# EAGLE design boardMecanumArmFinal (EAGLE 7.7.0)
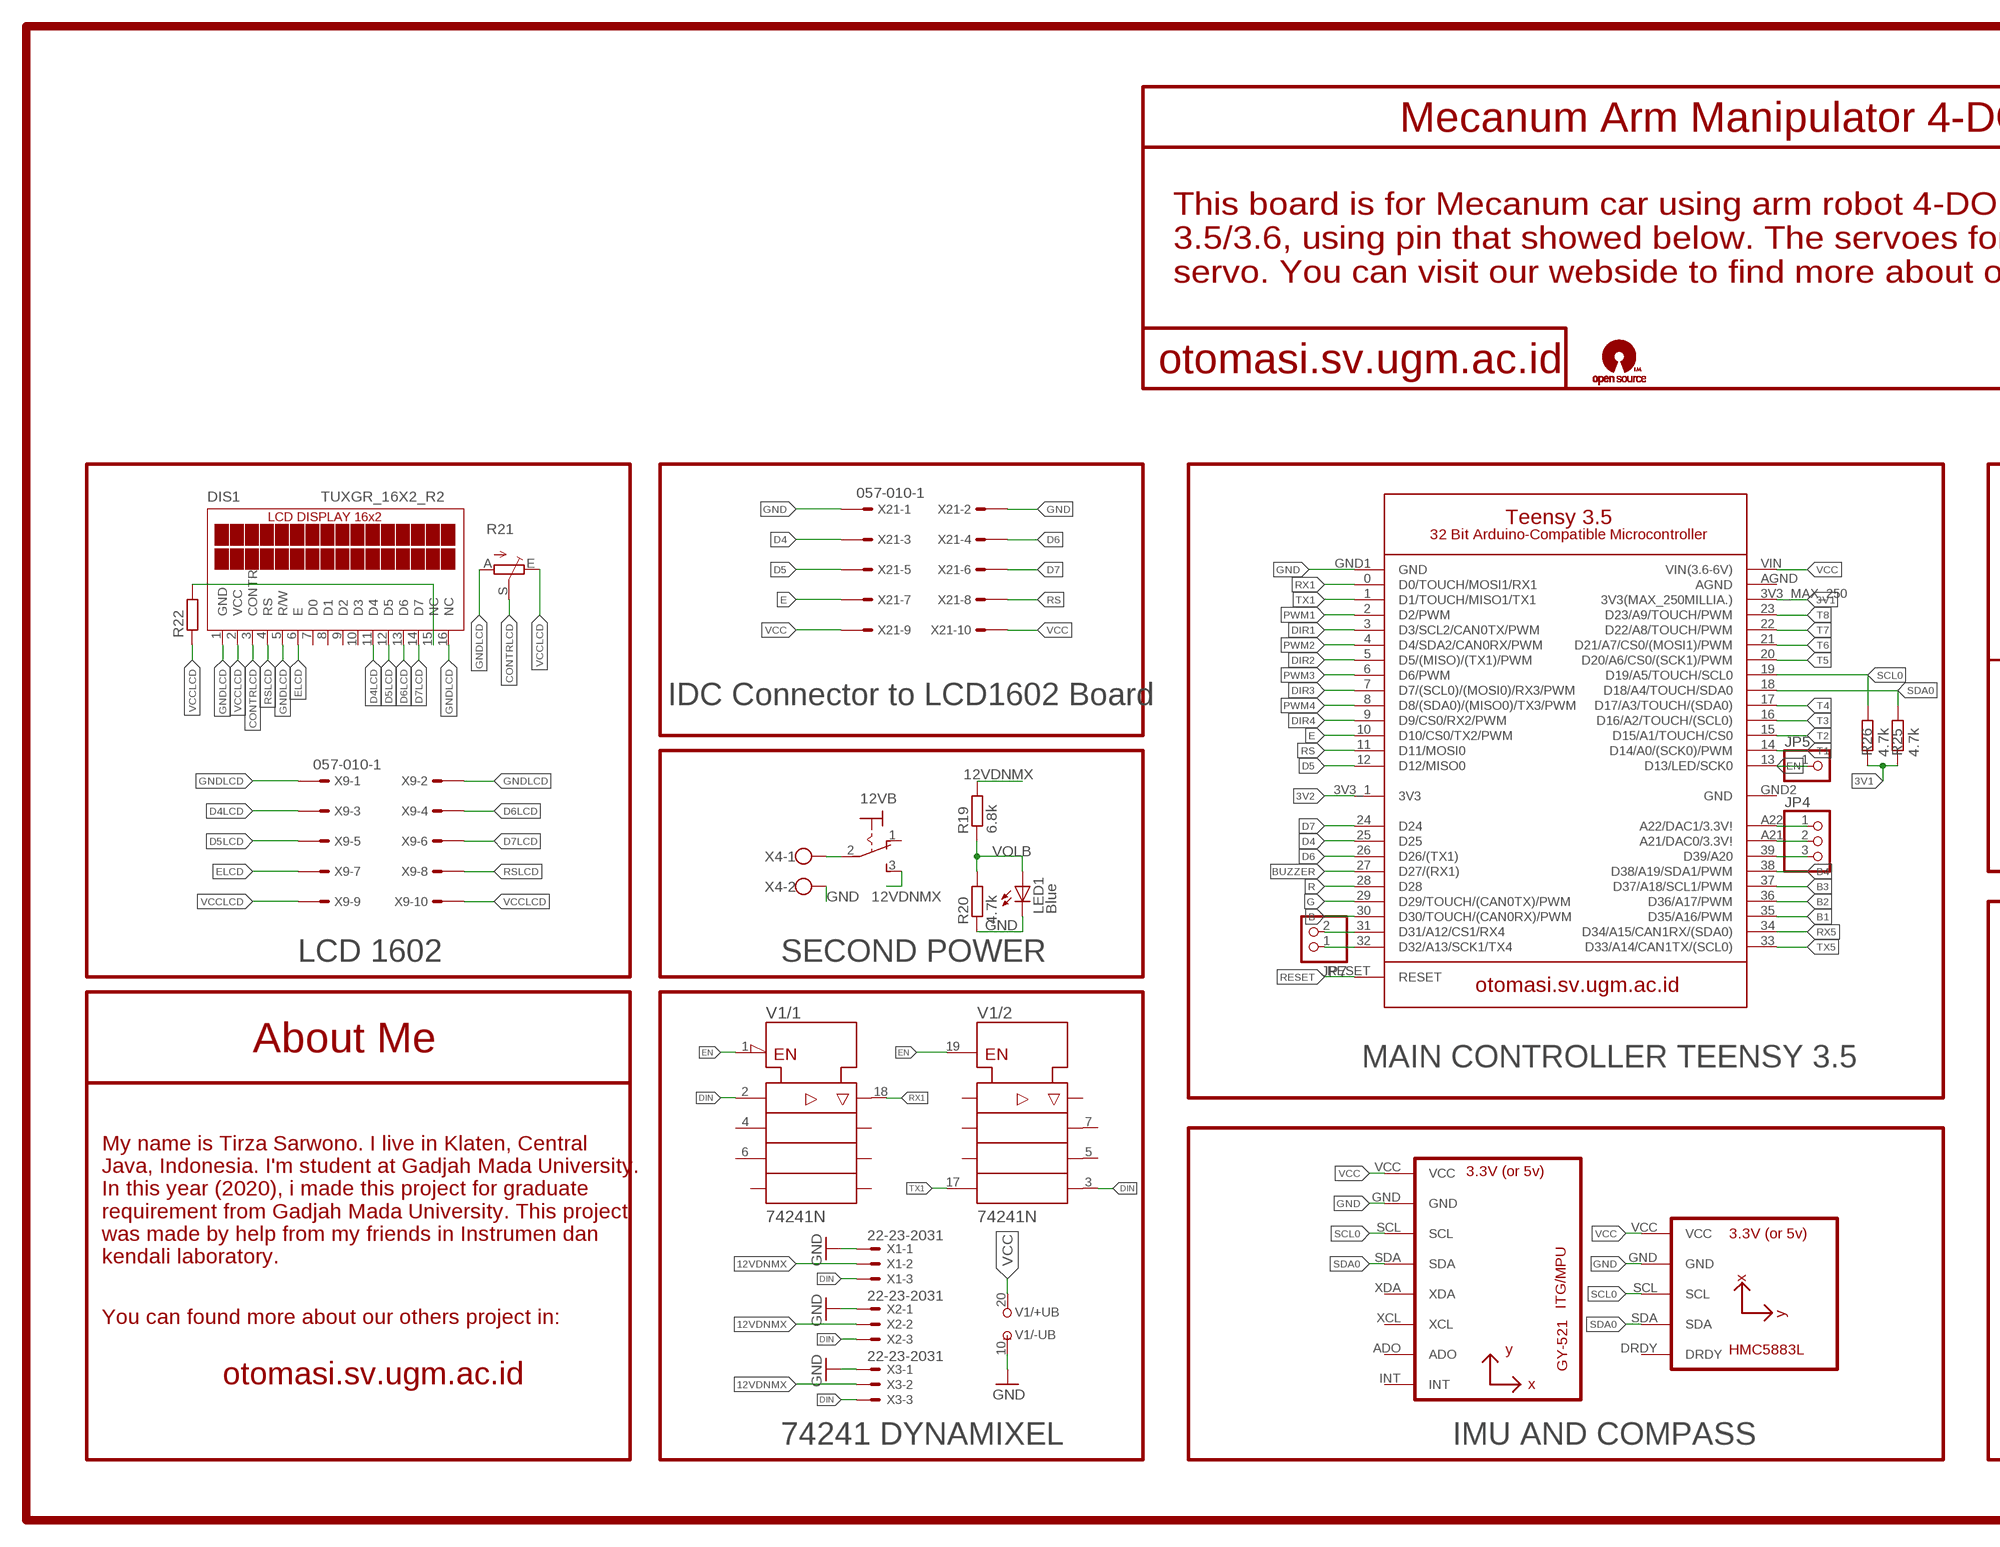
[diagram p0: schematic, sheet 1, part 1 of 2]
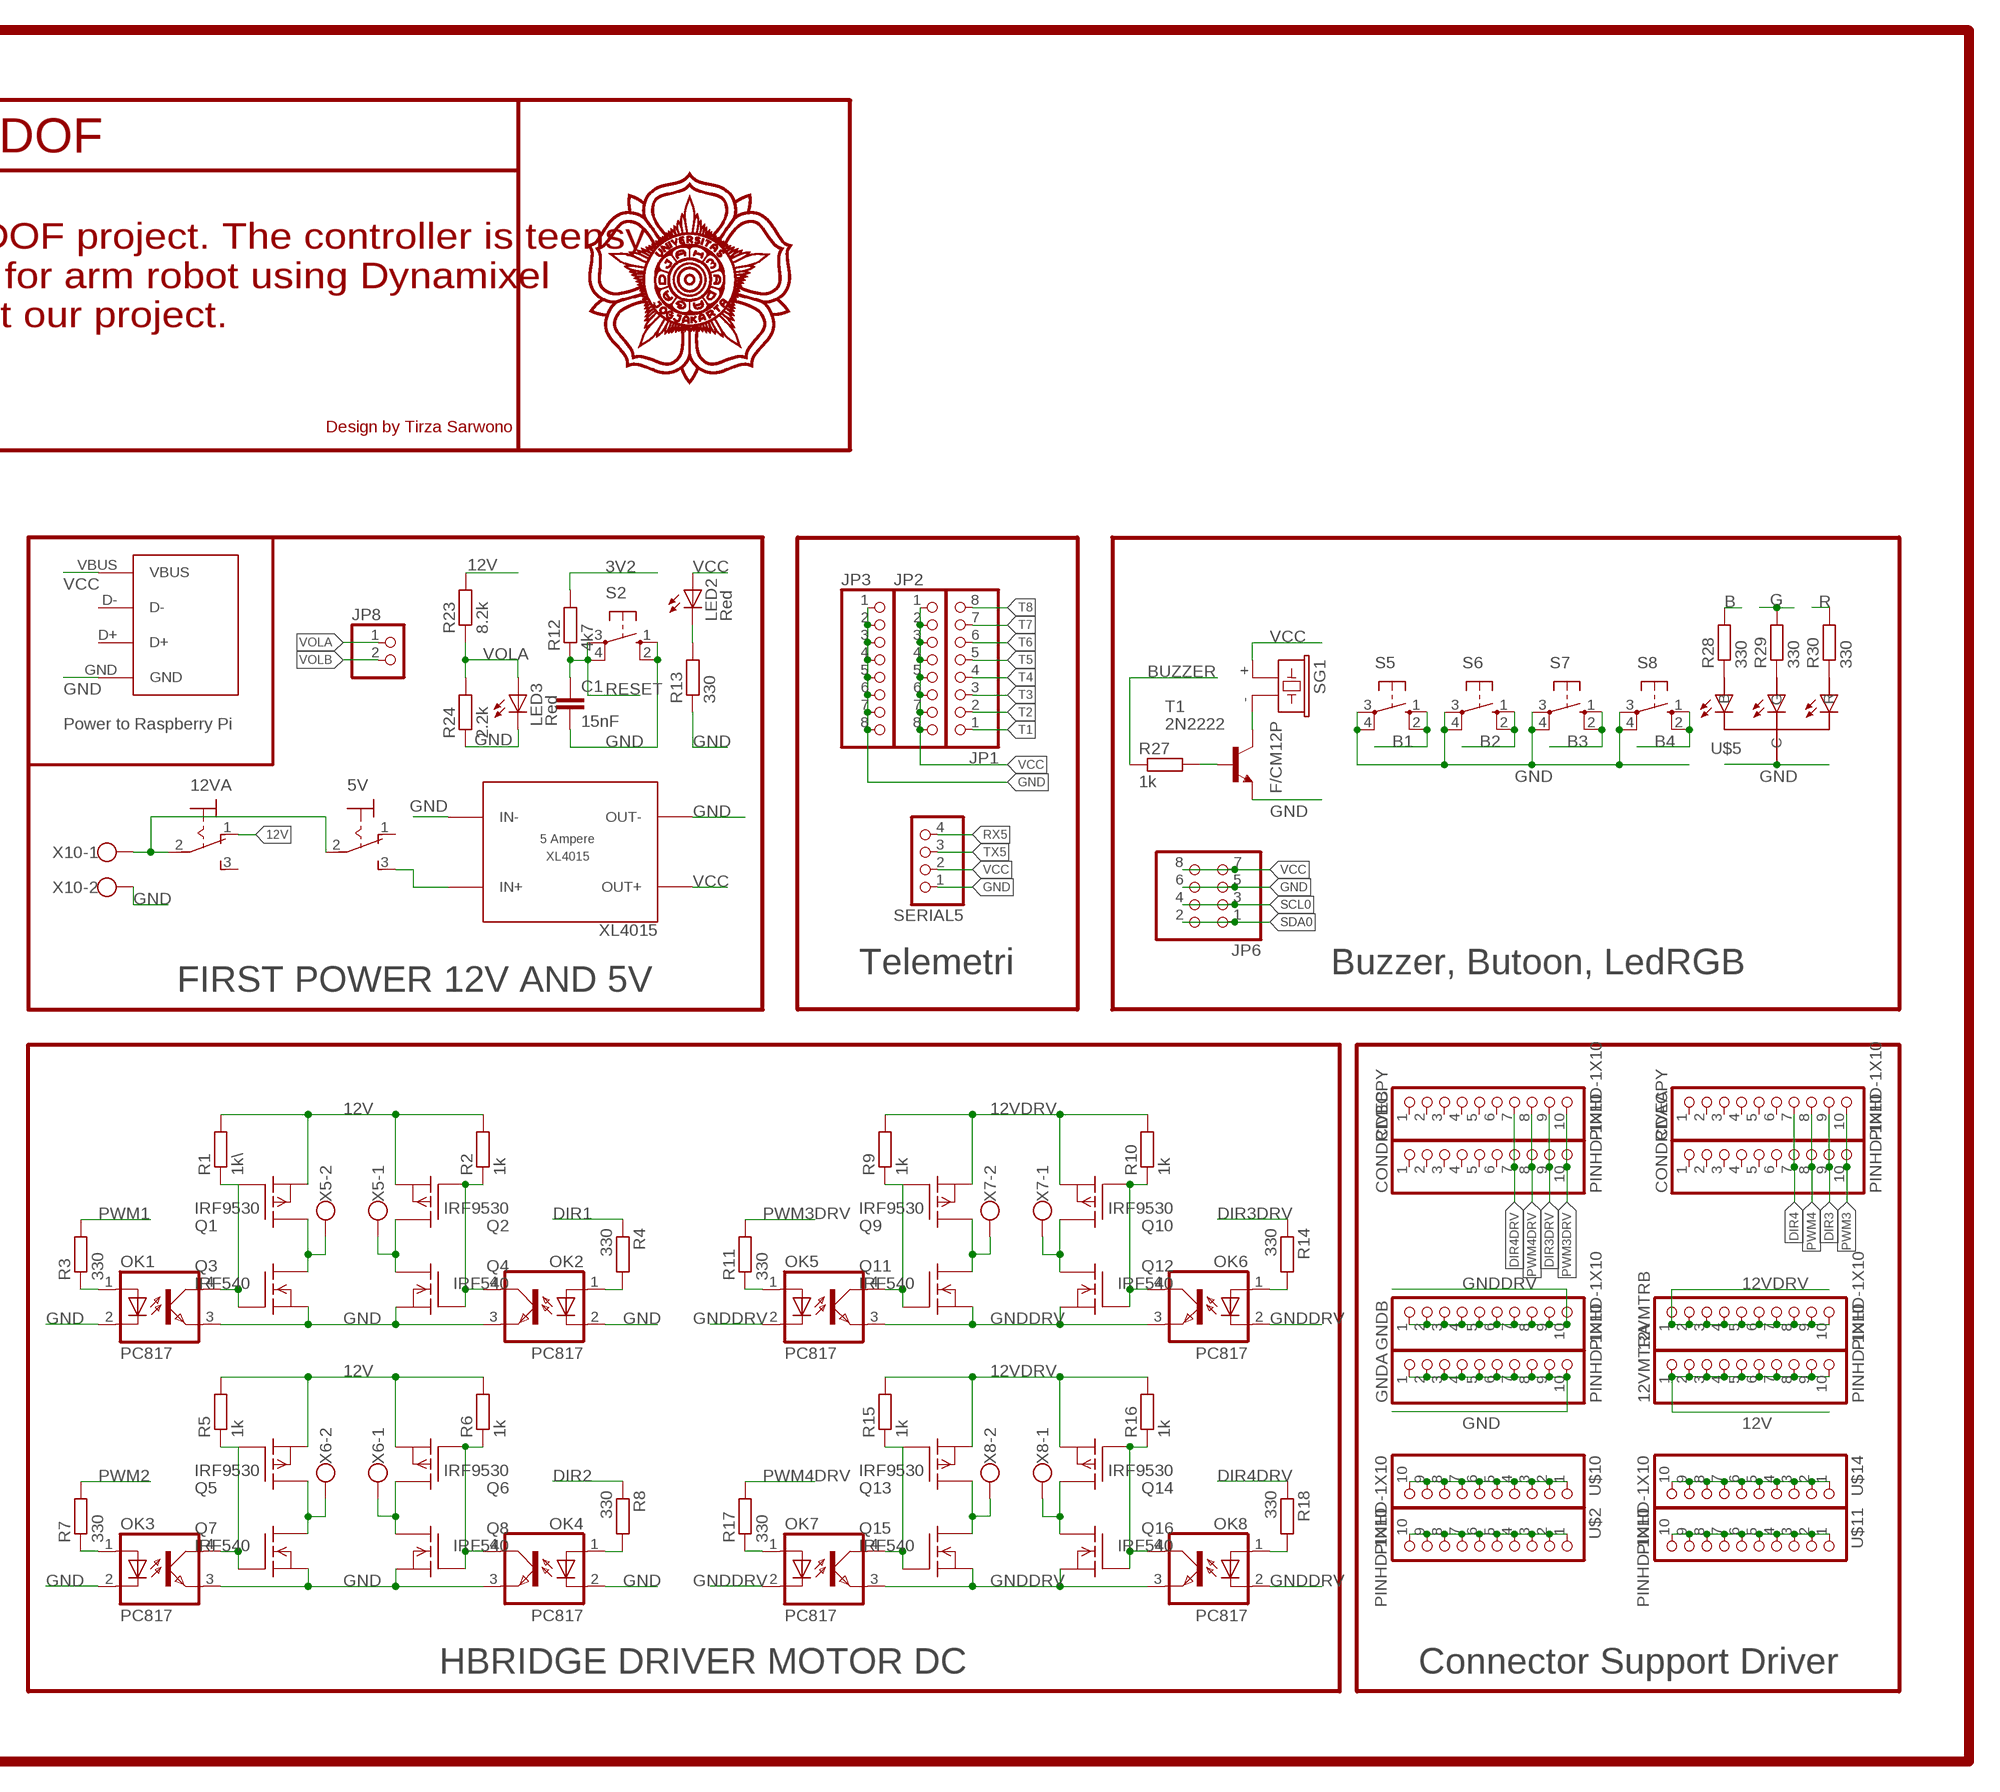
[diagram p1: schematic, sheet 1, part 2 of 2]

## Parts
5V  M9040P  [M9040P]
12VA  M9040P  [M9040P]
12VB  M9040P  [M9040P]
12VMTRA  PINHD-1X10  [1X10-BIG]
12VMTRB  PINHD-1X10  [1X10-BIG]
C1  15nF  C-EUC0805  [C0805]
CDACPY  PINHD-1X10  [1X10-BIG]
CDBCPY  PINHD-1X10  [1X10-BIG]
CONDRIVEA  PINHD-1X10  [1X10-BIG]
CONDRIVEB  PINHD-1X10  [1X10-BIG]
DIS1  TUXGR_16X2_R2  [TUXGR_16X2_R2]
GNDA  PINHD-1X10  [1X10-BIG]
GNDB  PINHD-1X10  [1X10-BIG]
JP1  PINHD-1X8BIG  [1X08-BIG]
JP2  PINHD-1X8BIG  [1X08-BIG]
JP3  PINHD-1X8BIG  [1X08-BIG]
JP4  PINHD-1X3  [1X03]
JP5  PINHD-1X1  [1X01]
JP6  PINHD-2X4  [2X04]
JP7  PINHD-1X2  [1X02]
JP8  PINHD-1X2  [1X02]
LED1  Blue  LED3MM  [LED3MM]
LED2  Red  LED3MM  [LED3MM]
LED3  Red  LED3MM  [LED3MM]
OK1  PC817  [DIL04]
OK2  PC817  [DIL04]
OK3  PC817  [DIL04]
OK4  PC817  [DIL04]
OK5  PC817  [DIL04]
OK6  PC817  [DIL04]
OK7  PC817  [DIL04]
OK8  PC817  [DIL04]
Q1  IRF9530  [TO220]
Q2  IRF9530  [TO220]
Q3  IRF540  [TO220]
Q4  IRF540  [TO220]
Q5  IRF9530  [TO220]
Q6  IRF9530  [TO220]
Q7  IRF540  [TO220]
Q8  IRF540  [TO220]
Q9  IRF9530  [TO220]
Q10  IRF9530  [TO220]
Q11  IRF540  [TO220]
Q12  IRF540  [TO220]
Q13  IRF9530  [TO220]
Q14  IRF9530  [TO220]
Q15  IRF540  [TO220]
Q16  IRF540  [TO220]
R1  1k\  R-EU_0207/7  [0207/7]
R2  1k  R-EU_0207/7  [0207/7]
R3  330  R-EU_0207/7  [0207/7]
R4  330  R-EU_0207/7  [0207/7]
R5  1k  R-EU_0207/7  [0207/7]
R6  1k  R-EU_0207/7  [0207/7]
R7  330  R-EU_0207/7  [0207/7]
R8  330  R-EU_0207/7  [0207/7]
R9  1k  R-EU_0207/7  [0207/7]
R10  1k  R-EU_0207/7  [0207/7]
R11  330  R-EU_0207/7  [0207/7]
R12  4k7  R-EU_R1206  [R1206]
R13  330  R-EU_0207/7  [0207/7]
R14  330  R-EU_0207/7  [0207/7]
R15  1k  R-EU_0207/7  [0207/7]
R16  1k  R-EU_0207/7  [0207/7]
R17  330  R-EU_0207/7  [0207/7]
R18  330  R-EU_0207/7  [0207/7]
R19  6.8k  R-EU_0207/10  [0207/10]
R20  4.7k  R-EU_0207/10  [0207/10]
R21  TRIM_EU-B25P  [B25P]
R22  R-EU_0207/7  [0207/7]
R23  8.2k  R-EU_0207/10  [0207/10]
R24  2.2k  R-EU_0207/10  [0207/10]
R25  4.7k  R-EU_R1206  [R1206]
R26  4.7k  R-EU_R1206  [R1206]
R27  1k  R-EU_R1206  [R1206]
R28  330  R-EU_R1206  [R1206]
R29  330  R-EU_R1206  [R1206]
R30  330  R-EU_R1206  [R1206]
S2  10-XX  [B3F-10XX]
S5  10-XX  [B3F-10XX]
S6  10-XX  [B3F-10XX]
S7  10-XX  [B3F-10XX]
S8  10-XX  [B3F-10XX]
SERIAL5  PINHD-1X4  [1X04]
SG1  F/CM12P  [F/CM12P]
T1  2N2222  [TO92-EBC-OVAL]
U1  HMC5883LMPU6050  [HMC5883L]
U$1  GY-521MPU6050  [GY-521]
U$2  PINHD-1X10  [1X10-BIG]
U$3  TEENSY_35TEENSY_3.5  [TEENSY_35]
U$4  FEMALEUSBTODIP  [FEMALEUSBTODIP]
U$5  RGB_CC  [RGB_CC]
U$10  PINHD-1X10  [1X10-BIG]
U$11  PINHD-1X10  [1X10-BIG]
U$14  PINHD-1X10  [1X10-BIG]
V1  74241N  [DIL20]
X1  22-23-2031  [22-23-2031]
X2  22-23-2031  [22-23-2031]
X3  22-23-2031  [22-23-2031]
X4  W237-102  [W237-102]
X5  W237-102  [W237-102]
X6  W237-102  [W237-102]
X7  W237-102  [W237-102]
X8  W237-102  [W237-102]
X9  057-010-1  [057-010-1]
X10  W237-102  [W237-102]
X21  057-010-1  [057-010-1]
XL4015  XL4015  [XL4015]

## Nets
3V1: R25.2 R26.2 U$3.3V3_MAX_250(3V3(MAX_250MILLIA.))
3V2: R12.2 U$3.3V3_1(3V3)
12V: 12VA.1(O) 12VMTRA.1 12VMTRA.2 12VMTRA.3 12VMTRA.4 12VMTRA.5 12VMTRA.6 12VMTRA.7 12VMTRA.8 12VMTRA.9 12VMTRA.10 Q1.3(S) Q2.3(S) Q5.3(S) Q6.3(S) R1.2 R2.2 R5.2 R6.2 R23.2
12VDNMX: 12VB.3(S) R19.2 X1.2 X2.2 X3.2
12VDRV: 12VMTRB.1 12VMTRB.2 12VMTRB.3 12VMTRB.4 12VMTRB.5 12VMTRB.6 12VMTRB.7 12VMTRB.8 12VMTRB.9 12VMTRB.10 Q9.3(S) Q10.3(S) Q13.3(S) Q14.3(S) R9.2 R10.2 R15.2 R16.2
B: R28.2 U$3.30(D30/TOUCH/(CAN0RX)/PWM)
B1: S5.1(S) S5.2(S1) U$3.35(D35/A16/PWM)
B2: S6.1(S) S6.2(S1) U$3.36(D36/A17/PWM)
B3: S7.1(S) S7.2(S1) U$3.37(D37/A18/SCL1/PWM)
B4: S8.1(S) S8.2(S1) U$3.38(D38/A19/SDA1/PWM)
BUZZER: R27.1 U$3.27(D27/(RX1))
CONTRLCD: DIS1.3(CONTR) R21.S
D4: U$3.25(D25) X21.3
D4LCD: DIS1.11(D4) X9.3
D5: U$3.12(D12/MISO0) X21.5
D5LCD: DIS1.12(D5) X9.5
D6: U$3.26(D26/(TX1)) X21.4
D6LCD: DIS1.13(D6) X9.4
D7: U$3.24(D24) X21.6
D7LCD: DIS1.14(D7) X9.6
DIN: V1.2(/1:A1) V1.3(/2:Y4) X1.3 X2.3 X3.3
DIR1: R4.1 U$3.3(D3/SCL2/CAN0TX/PWM)
DIR2: R8.1 U$3.5(D5/(MISO)/(TX1)/PWM)
DIR3: CDACPY.9 CONDRIVEA.9 U$3.7(D7/(SCL0)/(MOSI0)/RX3/PWM)
DIR3DRV: CDBCPY.9 CONDRIVEB.9 R14.1
DIR4: CDACPY.7 CONDRIVEA.7 U$3.9(D9/CS0/RX2/PWM)
DIR4DRV: CDBCPY.7 CONDRIVEB.7 R18.1
E: U$3.10(D10/CS0/TX2/PWM) X21.7
ELCD: DIS1.6(E) X9.7
EN: JP5.1 U$3.13(D13/LED/SCK0) V1.1(/1:!G) V1.19(/2:G)
G: R29.2 U$3.29(D29/TOUCH/(CAN0TX)/PWM)
GND: C1.2 GNDA.1 GNDA.2 GNDA.3 GNDA.4 GNDA.5 GNDA.6 GNDA.7 GNDA.8 GNDA.9 GNDA.10 JP3.1 JP3.2 JP3.3 JP3.4 JP3.5 JP3.6 JP3.7 JP3.8 JP6.5 JP6.6 LED1.K(C) LED3.K(C) OK1.2(C) OK1.3(EMIT) OK2.2(C) OK2.3(EMIT) OK3.2(C) OK3.3(EMIT) OK4.2(C) OK4.3(EMIT) Q3.3(S) Q4.3(S) Q7.3(S) Q8.3(S) R13.1 R20.1 R24.1 S2.1(S) S2.2(S1) S5.3(P) S5.4(P1) S6.3(P) S6.4(P1) S7.3(P) S7.4(P1) S8.3(P) S8.4(P1) SERIAL5.1 T1.E U1.GND U$1.GND U$3.GND1(GND) U$4.GND U$5.C V1.10(/-UB:-UB) X1.1 X2.1 X3.1 X4.2 X10.2 X21.1 X21.2 XL4015.IN- XL4015.OUT-
GNDDRV: GNDB.1 GNDB.2 GNDB.3 GNDB.4 GNDB.5 GNDB.6 GNDB.7 GNDB.8 GNDB.9 GNDB.10 OK5.2(C) OK5.3(EMIT) OK6.2(C) OK6.3(EMIT) OK7.2(C) OK7.3(EMIT) OK8.2(C) OK8.3(EMIT) Q11.3(S) Q12.3(S) Q15.3(S) Q16.3(S)
GNDLCD: DIS1.1(GND) DIS1.5(R/W) DIS1.16(NC) R21.A X9.1 X9.2
N$1: Q1.2(D) Q3.2(D) X5.2
N$2: Q2.2(D) Q4.2(D) X5.1
N$3: OK1.4(COL) Q1.1(G) Q3.1(G) R1.1
N$4: Q5.2(D) Q7.2(D) X6.2
N$5: R27.2 T1.B
N$7: OK2.4(COL) Q2.1(G) Q4.1(G) R2.1
N$8: Q6.2(D) Q8.2(D) X6.1
N$9: OK3.4(COL) Q5.1(G) Q7.1(G) R5.1
N$10: OK4.4(COL) Q6.1(G) Q8.1(G) R6.1
N$11: OK1.1(A) R3.1
N$12: OK3.1(A) R7.1
N$13: OK2.1(A) R4.2
N$14: OK4.1(A) R8.2
N$15: Q9.2(D) Q11.2(D) X7.2
N$16: Q10.2(D) Q12.2(D) X7.1
N$17: OK5.4(COL) Q9.1(G) Q11.1(G) R9.1
N$18: OK6.4(COL) Q10.1(G) Q12.1(G) R10.1
N$19: OK5.1(A) R11.1
N$20: OK6.1(A) R14.2
N$21: Q13.2(D) Q15.2(D) X8.2
N$22: Q14.2(D) Q16.2(D) X8.1
N$23: OK7.4(COL) Q13.1(G) Q15.1(G) R15.1
N$24: OK8.4(COL) Q14.1(G) Q16.1(G) R16.1
N$25: OK7.1(A) R17.1
N$26: OK8.1(A) R18.2
N$31: 12VB.2(P) X4.1
N$32: JP4.3 U$3.39(D39/A20)
N$33: 5V.2(P) 12VA.2(P) X10.1
N$34: 5V.3(S) XL4015.IN+
N$35: LED2.K(C) R13.2
N$36: U$10.1 U$10.2 U$10.3 U$10.4 U$10.5 U$10.6 U$10.7 U$10.8 U$10.9 U$10.10
N$37: R28.1 U$5.B
N$38: SG1.- T1.C
N$39: R29.1 U$5.G
N$40: R30.1 U$5.R
N$41: JP4.2 U$3.A21(A21/DAC0/3.3V!)
N$42: DIS1.15(NC) R22.2
N$43: JP4.1 U$3.A22(A22/DAC1/3.3V!)
N$44: U$2.1 U$2.2 U$2.3 U$2.4 U$2.5 U$2.6 U$2.7 U$2.8 U$2.9 U$2.10
N$45: U$14.1 U$14.2 U$14.3 U$14.4 U$14.5 U$14.6 U$14.7 U$14.8 U$14.9 U$14.10
N$46: JP7.1 U$3.32(D32/A13/SCK1/TX4)
N$47: JP7.2 U$3.31(D31/A12/CS1/RX4)
N$49: U$11.1 U$11.2 U$11.3 U$11.4 U$11.5 U$11.6 U$11.7 U$11.8 U$11.9 U$11.10
PWM1: R3.2 U$3.2(D2/PWM)
PWM2: R7.2 U$3.4(D4/SDA2/CAN0RX/PWM)
PWM3: CDACPY.10 CONDRIVEA.10 U$3.6(D6/PWM)
PWM3DRV: CDBCPY.10 CONDRIVEB.10 R11.2
PWM4: CDACPY.8 CONDRIVEA.8 U$3.8(D8/(SDA0)/(MISO0)/TX3/PWM)
PWM4DRV: CDBCPY.8 CONDRIVEB.8 R17.2
R: R30.2 U$3.28(D28)
RESET: C1.1 R12.1 S2.3(P) S2.4(P1) U$3.RESET
RS: U$3.11(D11/MOSI0) X21.8
RSLCD: DIS1.4(RS) X9.8
RX1: U$3.0(D0/TOUCH/MOSI1/RX1) V1.18(/1:Y1)
RX5: SERIAL5.4 U$3.34(D34/A15/CAN1RX/(SDA0))
SCL0: JP6.3 JP6.4 R26.1 U1.SCL U$1.SCL U$3.19(D19/A5/TOUCH/SCL0)
SDA0: JP6.1 JP6.2 R25.1 U1.SDA U$1.SDA U$3.18(D18/A4/TOUCH/SDA0)
T1: JP1.1 U$3.14(D14/A0/(SCK0)/PWM)
T2: JP1.2 U$3.15(D15/A1/TOUCH/CS0)
T3: JP1.3 U$3.16(D16/A2/TOUCH/(SCL0))
T4: JP1.4 U$3.17(D17/A3/TOUCH/(SDA0))
T5: JP1.5 U$3.20(D20/A6/CS0/(SCK1)/PWM)
T6: JP1.6 U$3.21(D21/A7/CS0/(MOSI1)/PWM)
T7: JP1.7 U$3.22(D22/A8/TOUCH/PWM)
T8: JP1.8 U$3.23(D23/A9/TOUCH/PWM)
TX1: U$3.1(D1/TOUCH/MISO1/TX1) V1.17(/2:A4)
TX5: SERIAL5.3 U$3.33(D33/A14/CAN1TX/(SCL0))
VCC: JP2.1 JP2.2 JP2.3 JP2.4 JP2.5 JP2.6 JP2.7 JP2.8 JP6.7 JP6.8 LED2.A SERIAL5.2 SG1.+ U1.VCC U$1.VCC U$3.VIN(VIN(3.6-6V)) U$4.VBUS V1.20(/+UB:+UB) X21.9 X21.10 XL4015.OUT+
VCCLCD: DIS1.2(VCC) R21.E R22.1 X9.9 X9.10
VOLA: JP8.1 LED3.A R23.1 R24.2
VOLB: JP8.2 LED1.A R19.1 R20.2
Unconnected: 5V.1(O) 12VA.3(S) 12VB.1(O) CDACPY.1 CDACPY.2 CDACPY.3 CDACPY.4 CDACPY.5 CDACPY.6 CDBCPY.1 CDBCPY.2 CDBCPY.3 CDBCPY.4 CDBCPY.5 CDBCPY.6 CONDRIVEA.1 CONDRIVEA.2 CONDRIVEA.3 CONDRIVEA.4 CONDRIVEA.5 CONDRIVEA.6 CONDRIVEB.1 CONDRIVEB.2 CONDRIVEB.3 CONDRIVEB.4 CONDRIVEB.5 CONDRIVEB.6 DIS1.7(D0) DIS1.8(D1) DIS1.9(D2) DIS1.10(D3) U1.DRDY U$1.ADO U$1.INT U$1.XCL U$1.XDA U$4.D+ U$4.D- V1.4(/1:A2) V1.5(/2:Y3) V1.6(/1:A3) V1.7(/2:Y2)

## Notes on the sheet
- Mecanum Arm Manipulator 4-DOF
- This board is for Mecanum car using arm robot 4-DOF project. The controller is teensy 
  3.5/3.6, using pin that showed below. The servoes for arm robot using Dynamixel 
  servo. You can visit our webside to find more about our project.
- otomasi.sv.ugm.ac.id | Design by Tirza Sarwono
- Power to Raspberry Pi
- IDC Connector to LCD1602 Board
- Telemetri | Buzzer, Butoon, LedRGB
- FIRST POWER 12V AND 5V
- LCD 1602 | SECOND POWER
- About Me
- MAIN CONTROLLER TEENSY 3.5
- My name is Tirza Sarwono. I live in Klaten, Central
  Java, Indonesia. I'm student at Gadjah Mada University. 
  In this year (2020), i made this project for graduate 
  requirement from Gadjah Mada University. This project 
  was made by help from my friends in Instrumen dan 
  kendali laboratory.
- You can found more about our others project in:
- otomasi.sv.ugm.ac.id
- 74241 DYNAMIXEL | IMU AND COMPASS | HBRIDGE DRIVER MOTOR DC | Connector Support Driver

## Power pins joined to a net without a drawn wire
AGND: U$3.AGND
GND: U$3.GND2(GND)

## Library data of the parts
5V 12VA 12VB = switch:M9040P: TOGGLE SWITCH Marquardt
12VMTRA 12VMTRB CDACPY CDBCPY CONDRIVEA CONDRIVEB GNDA GNDB U$2 U$10 U$11 U$14 = adafruit:PINHD-1X10: Pin header 1x10 0.1" spacing With round pins
C1 = rcl:C-EU: CAPACITOR, European symbol
DIS1 = display-lcd:TUXGR_16X2_R2: Tuxgraphics LCD display 16x2 characters reflective, without background light Source: tuxgr_12x2_r2.pdf; OC_FARNELL: unknown; OC_NEWARK: unknown
JP1-JP3 = adafruit:PINHD-1X8: PIN HEADER
JP4 = adafruit:PINHD-1X3: PIN HEADER
JP5 = adafruit:PINHD-1X1: Pin header 1x1 for 0.1" spacing With round pins
JP6 = pinhead:PINHD-2X4: PIN HEADER
JP7 JP8 = pinhead:PINHD-1X2: PIN HEADER
LED1-LED3 = led:LED: LED OSRAM: - CHIPLED LG R971, LG N971, LY N971, LG Q971, LY Q971, LO R971, LY R971 LH N974, LH R974 LS Q976, LO Q976, LY Q976 LO Q996 - Hyper CHIPLED LW Q18S LB Q993, LB Q99A, LB R99A - SideLED LS A670, LO A670, LY A670, LG A670, LP A670 LB A673, LV A673, LT A673, LW A673 LH A674 LY A675 LS A676, LA A676, LO A676, LY A676, LW A676 LS A679, LY A679, LG A679 - Hyper Micro SIDELED® LS Y876, LA Y876, LO Y876, LY Y876 LT Y87S - SmartLED LW L88C, LW L88S LB L89C, LB L89S, LG L890 LS L89K, LO L89K, LY L89K LS L896, LA L896, LO L896, LY L896 - TOPLED LS T670, LO T670, LY T670, LG T670, LP T670 LSG T670, LSP T670, LSY T670, LOP T670, LYG T670 LG T671, LOG T671, LSG T671 LB T673, LV T673, LT T673, LW T673 LH T674 LS T676, LA T676, LO T676, LY T676, LB T676, LH T676, LSB T676, LW T676 LB T67C, LV T67C, LT T67C, LS T67K, LO T67K, LY T67K, LW E67C LS E67B, LA E67B, LO E67B, LY E67B, LB E67C, LV E67C, LT E67C LW T67C LS T679, LY T679, LG T679 LS T770, LO T770, LY T770, LG T770, LP T770 LB T773, LV T773, LT T773, LW T773 LH T774 LS E675, LA E675, LY E675, LS T675 LS T776, LA T776, LO T776, LY T776, LB T776 LHGB T686 LT T68C, LB T68C - Hyper Mini TOPLED® LB M676 - Mini TOPLED Santana® LG M470 LS M47K, LO M47K, LY M47K Source: http://www.osram.convergy.de LUXEON: - LUMILED® LXK2-PW12-R00, LXK2-PW12-S00, LXK2-PW14-U00, LXK2-PW14-V00 LXK2-PM12-R00, LXK2-PM12-S00, LXK2-PM14-U00 LXK2-PE12-Q00, LXK2-PE12-R00, LXK2-PE12-S00, LXK2-PE14-T00, LXK2-PE14-U00 LXK2-PB12-K00, LXK2-PB12-L00, LXK2-PB12-M00, LXK2-PB14-N00, LXK2-PB14-P00, LXK2-PB14-Q00 LXK2-PR12-L00, LXK2-PR12-M00, LXK2-PR14-Q00, LXK2-PR14-R00 LXK2-PD12-Q00, LXK2-PD12-R00, LXK2-PD12-S00 LXK2-PH12-R00, LXK2-PH12-S00 LXK2-PL12-P00, LXK2-PL12-Q00, LXK2-PL12-R00 Source: www.luxeon.com KINGBRIGHT: KA-3528ASYC Source: www.kingbright.com
OK1-OK8 = PIC817:PC817: SHARP OPTO COUPLER; MPN: PC817X4J000F; OC_FARNELL: 9707727; OC_NEWARK: 97K7059
Q1 Q2 Q5 Q6 Q9 Q10 Q13 Q14 = transistor-fet:IRF9530: P-Channel Enhancement MOSFET (HEXFET); -100V; -12A; 0,3Ohm
Q3 Q4 Q7 Q8 Q11 Q12 Q15 Q16 = transistor-fet:IRF540: N-Channel Enhancement MOSFET (HEXFET); 100V; 28A; 0,077Ohm
R1-R20 R22-R30 = rcl:R-EU_: RESISTOR, European symbol
R21 = pot:TRIM_EU-: POTENTIOMETER
S2 S5-S8 = switch-omron:10-XX: OMRON SWITCH; MPN: B3F-1000; OC_FARNELL: 176432; OC_NEWARK: 36M3542
SERIAL5 = pinhead:PINHD-1X4: PIN HEADER
SG1 = buzzer:F/CM12P: BUZZER Source: Buerklin; OC_FARNELL: unknown; OC_NEWARK: unknown
T1 = adafruit:2N2222: NPN TRANSISTOR Big oval pads
U1 = HMC5883L:HMC5883L
U$1 = MPU6050:GY-521
U$3 = teensy35NoInside:TEENSY_35: otomasi.sv.ugm.ac.id
U$4 = femaleUsbToDIP:FEMALEUSBTODIP: otomasi.sv.ugm.ac.id
U$5 = ledRGB5MM:RGB_CC: otomasi.sv.ugm.ac.id
V1 = 74241custom:74*241: otomasi.sv.ugm.ac.id
X1-X3 = con-molex:22-23-2031: .100" (2.54mm) Center Header - 3 Pin; MF: MOLEX; MPN: 22-23-2031; OC_FARNELL: 1462950; OC_NEWARK: 30C0862
X4-X8 X10 = wago102:W237-102: WAGO SCREW CLAMP; MPN: 237-102; OC_FARNELL: unknown; OC_NEWARK: 70K9898
X9 X21 = con-panduit:057-010-: CONNECTOR 10-pin series 057 contact pc board low profile headers; OC_FARNELL: unknown; OC_NEWARK: unknown
XL4015 = xl4015:XL4015: otomasi.sv.ac.id

## Board
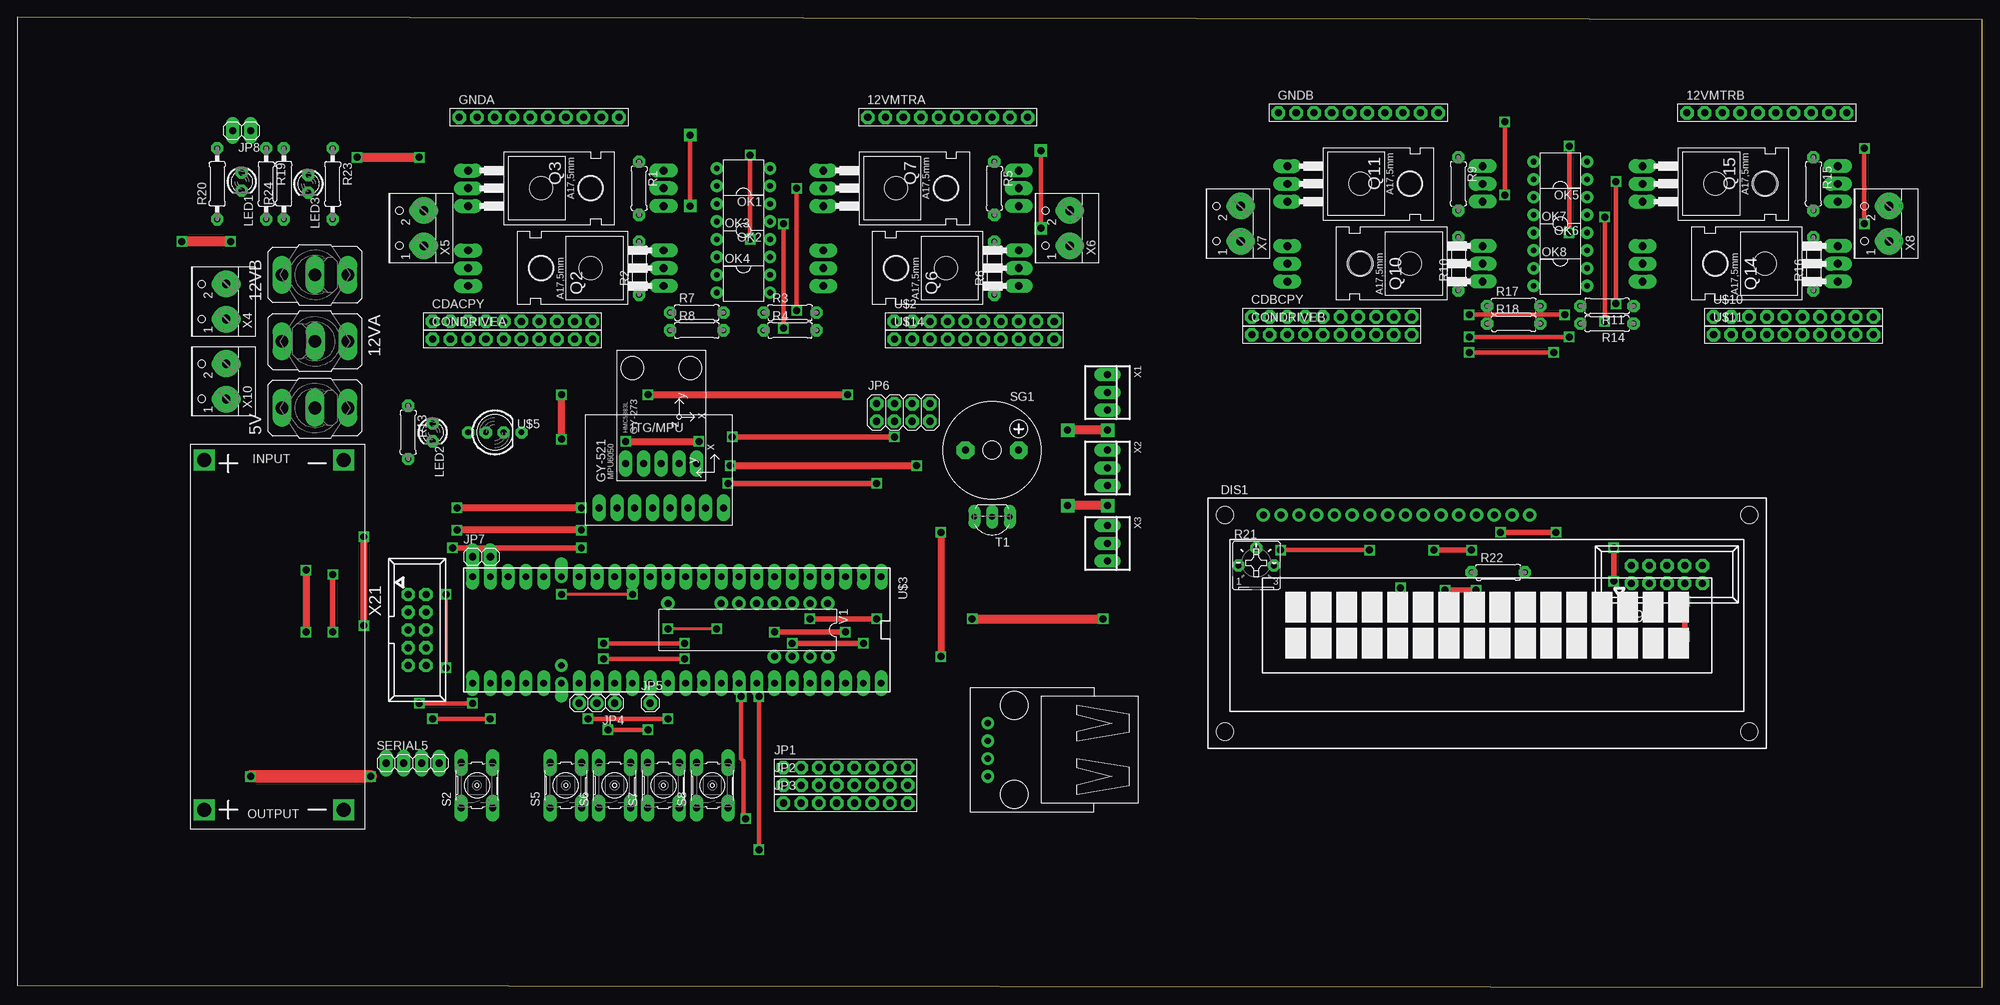
[diagram p2: board, top side]
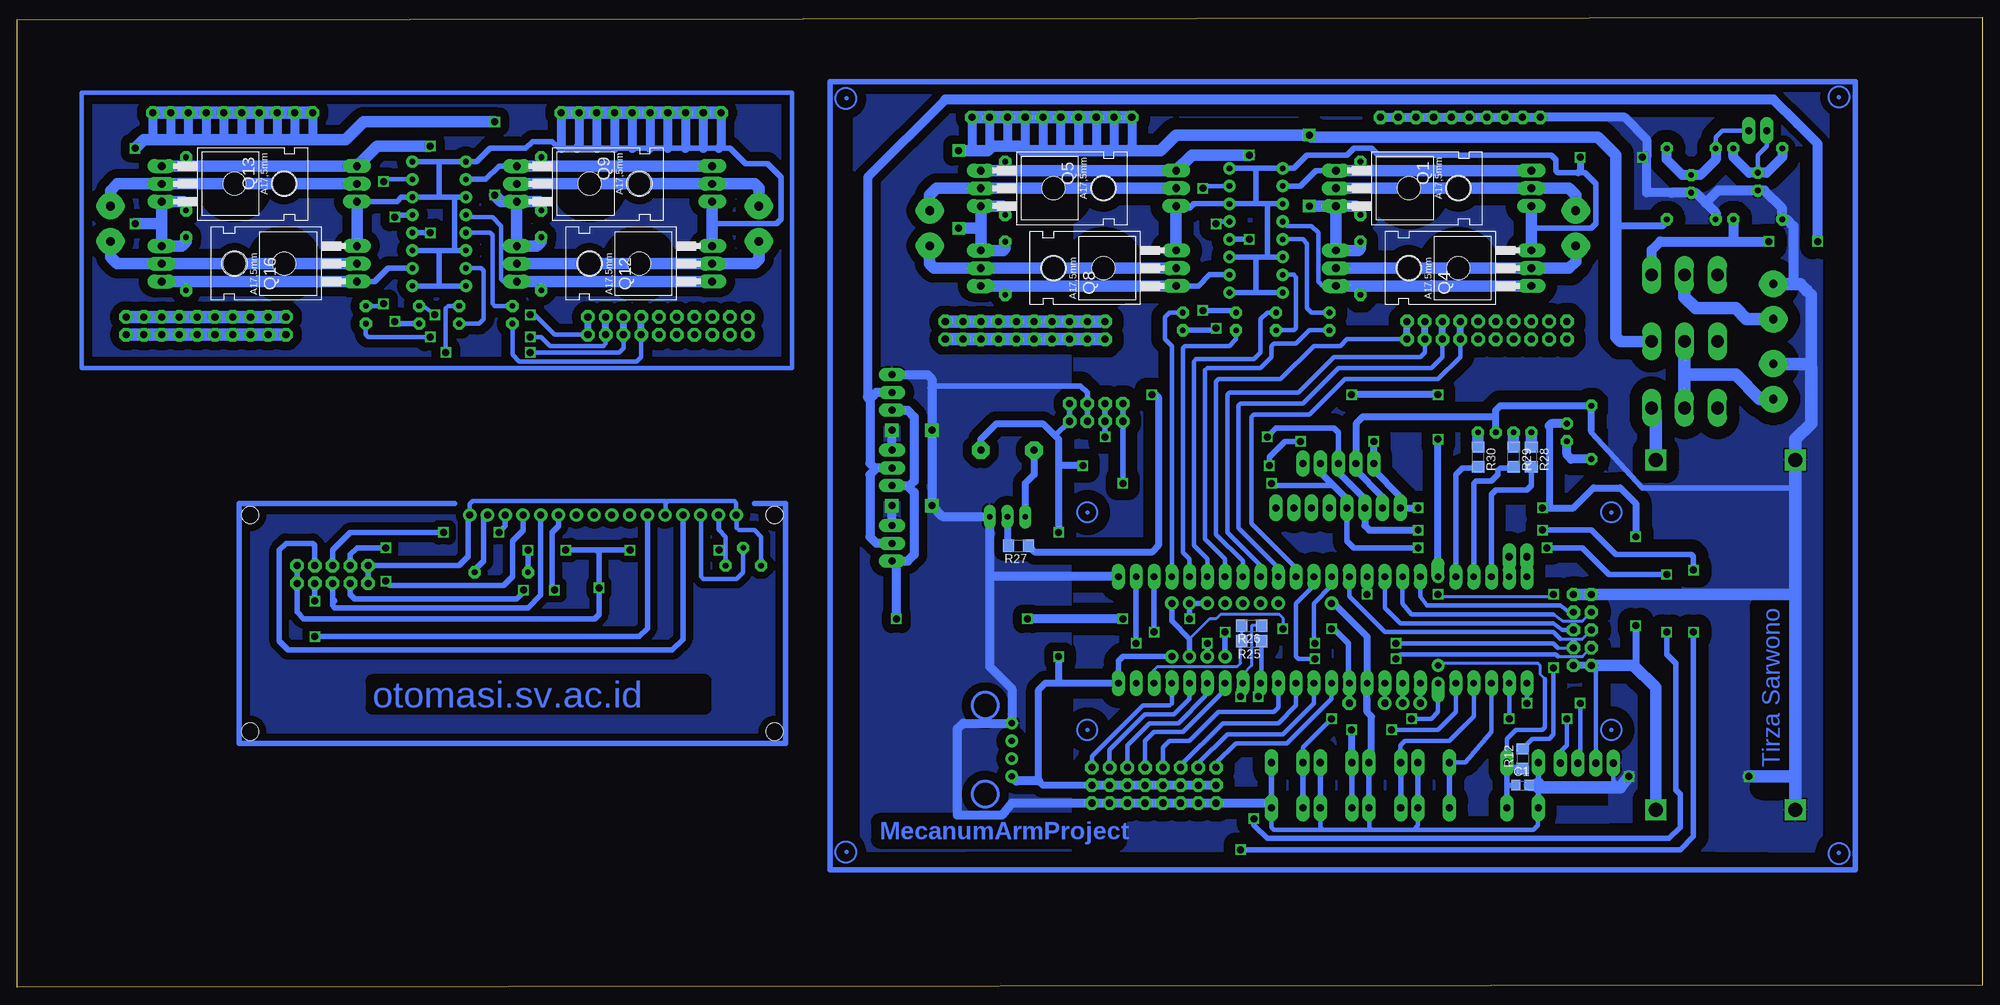
[diagram p3: board, bottom side, seen from below]

Size 280.97 x 138.73 mm. Coordinates in mm from the lower left corner, seen from the top.
Outline: 0,0.32 280.97,0 280.97,138.42 0,138.73 0,0.32
Copper layers (1*16): Top 0.035mm / dielectric 1.5mm / Bottom 0.035mm
Design rules "default *": minimum track width 10mil, minimum drill 24mil, track to track 8mil, track to pad 8mil, pad to pad 8mil, via to via 8mil, smd to smd 8mil, copper to edge 40mil, drill to drill 8mil, minimum pad ring 18mil, minimum via ring 8mil, stop-mask expansion 4mil, vias tented up to drill 0mil, thermal gap 10mil
vRestrict: area 21.9,130.5 to 23.4,131.1; area 159.8,130.5 to 161.3,131.1; area 87.4,131.2 to 95.8,133; area 19.4,127.1 to 20,128.6; area 19.4,18.4 to 20,19.9; area 20.1,69.3 to 21.9,77.7; 12 lines
Milling: area 386.1,87.5 to 391.5,92.9; area 291.3,87.6 to 296.7,93; area 293.7,90 to 294.4,90.7; area 388.4,89.8 to 389.1,90.5; area 296.6,86.1 to 297.1,86.6; area 296.5,83.5 to 297.2,84.1; area 381.6,115.2 to 382.3,115.9; area 300.4,115.3 to 301,115.9; area 385.4,83.5 to 386.1,84.2; area 385.6,45.1 to 391,50.5; area 290.8,45.2 to 296.2,50.6; area 293.2,47.6 to 293.9,48.3; 24 more areas; 16 lines

### Footprints (pad centres in the part's own frame; a part is rotated, then mirrored left to right if it is on the bottom)
M9040P = drill 1.803 long: 1 0,4.699; 2 0,0; 3 0,-4.699
1X10-BIG = drill 1.016 pad 1.778 octagon: 1 -11.43,0; 2 -8.89,0; 3 -6.35,0; 4 -3.81,0; 5 -1.27,0; 6 1.27,0; 7 3.81,0; 8 6.35,0; 9 8.89,0; 10 11.43,0
C0805 = smd 1.3 x 1.5: 1 -0.95,0; 2 0.95,0
TUXGR_16X2_R2 = drill 1 pad 1.676: 1 -32,15.5; 2 -29.46,15.5; 3 -26.92,15.5; 4 -24.38,15.5; 5 -21.84,15.5; 6 -19.3,15.5; 7 -16.76,15.5; 8 -14.22,15.5; 9 -11.68,15.5; 10 -9.14,15.5; 11 -6.6,15.5; 12 -4.06,15.5; 13 -1.52,15.5; 14 1.02,15.5; 15 3.56,15.5; 16 6.1,15.5 | hole 2.5: -37.5,-15.5; 37.5,-15.5; -37.5,15.5; 37.5,15.5
1X08-BIG = drill 1.016 pad 1.778 octagon: 1 -8.89,0; 2 -6.35,0; 3 -3.81,0; 4 -1.27,0; 5 1.27,0; 6 3.81,0; 7 6.35,0; 8 8.89,0
1X03 = drill 1.016: 1 -2.54,0; 2 0,0; 3 2.54,0
1X01 = drill 1.016 pad 1.93 octagon: 1 0,0
2X04 = drill 1.016 octagon: 1 -3.81,-1.27; 2 -3.81,1.27; 3 -1.27,-1.27; 4 -1.27,1.27; 5 1.27,-1.27; 6 1.27,1.27; 7 3.81,-1.27; 8 3.81,1.27
1X02 = drill 1.016 long: 1 -1.27,0; 2 1.27,0
LED3MM = drill 0.813 octagon: A -1.27,0; K 1.27,0
DIL04 = drill 0.813 pad 1.778: 1 -1.27,-3.81; 2 1.27,-3.81; 3 1.27,3.81; 4 -1.27,3.81
TO220 = drill 1.118 long: 1 -2.54,-6.35; 2 0,-6.35; 3 2.54,-6.35 | hole 3.302: 0,11.176
0207/7 = drill 0.813 octagon: 1 -3.81,0; 2 3.81,0
R1206 = smd 1.6 x 1.803: 1 -1.422,0; 2 1.422,0
0207/10 = drill 0.813 octagon: 1 -5.08,0; 2 5.08,0
B25P = drill 0.813 octagon: A -2.54,0; E 2.54,0; S 0,2.54
B3F-10XX = drill 1.016 long: 1 -3.251,2.261; 2 3.251,2.261; 3 -3.251,-2.261; 4 3.251,-2.261
1X04 = drill 1.016 long: 1 -3.81,0; 2 -1.27,0; 3 1.27,0; 4 3.81,0
F/CM12P = drill 1.016 pad 2.54 octagon: + 3.81,0; - -3.81,0
TO92-EBC-OVAL = drill 0.813 long: B 0,-1.27; C 2.54,-1.27; E -2.54,-1.27
HMC5883L = drill 1 pad 1.422 long: DRDY 7.62,5.08; GND 7.62,-2.54; SCL 7.62,0; SDA 7.62,2.54; VCC 7.62,-5.08
GY-521 = drill 1 pad 1.778 long: ADO -8.89,-6.35; GND -8.89,6.35; INT -8.89,-8.89; SCL -8.89,3.81; SDA -8.89,1.27; VCC -8.89,8.89; XCL -8.89,-3.81; XDA -8.89,-1.27
TEENSY_35 = drill 0.965 pad 1.676 long: 0 -7.62,5.08; 1 -7.62,2.54; 2 -7.62,0; 3 -7.62,-2.54; 3V3_1 -7.62,-27.94; 3V3_MAX_250 7.62,2.54; 4 -7.62,-5.08; 5 -7.62,-7.62; 6 -7.62,-10.16; 7 -7.62,-12.7; 8 -7.62,-15.24; 9 -7.62,-17.78; 10 -7.62,-20.32; 11 -7.62,-22.86; 12 -7.62,-25.4; 13 7.62,-25.4; 14 7.62,-22.86; 15 7.62,-20.32; 16 7.62,-17.78; 17 7.62,-15.24; 18 7.62,-12.7; 19 7.62,-10.16; 20 7.62,-7.62; 21 7.62,-5.08; 22 7.62,-2.54; 23 7.62,0; 24 -7.62,-30.48; 25 -7.62,-33.02; 26 -7.62,-35.56; 28 -7.62,-40.64; 29 -7.62,-43.18; 30 -7.62,-45.72; 31 -7.62,-48.26; 32 -7.62,-50.8; 33 7.62,-50.8; 34 7.62,-48.26; 35 7.62,-45.72; 36 7.62,-43.18; 37 7.62,-40.64; 39 7.62,-35.56; A21 7.62,-33.02; A22 7.62,-30.48; AGND 7.62,5.08; GND1 -7.62,7.62; GND2 7.62,-27.94; VIN 7.62,7.62 | drill 0.965 pad 1.778 offset: 27 -7.62,-38.1; 38 7.62,-38.1 | drill 0.9 pad 1.778: RESET 5.08,-38.1
FEMALEUSBTODIP = drill 0.9 pad 1.778: D+ 0,-5.08; D- 2.54,-5.08; GND -2.54,-5.08; VBUS 5.08,-5.08
RGB_CC = drill 0.813 octagon: B -3.81,0; C 1.27,0; G -1.27,0; R 3.81,0
DIL20 = drill 1 pad 1.676: 1 -11.43,-3.81; 2 -8.89,-3.81; 3 -6.35,-3.81; 4 -3.81,-3.81; 5 -1.27,-3.81; 6 1.27,-3.81; 7 3.81,-3.81; 10 11.43,-3.81; 17 -3.81,3.81; 18 -6.35,3.81; 19 -8.89,3.81; 20 -11.43,3.81
22-23-2031 = drill 1 long: 1 -2.54,0; 2 0,0; 3 2.54,0
W237-102 = drill 1.194 long: 1 -2.5,-1.27; 2 2.5,-1.27 | drill 1.2 pad 3.81: 3 -2.54,-1.27; 4 2.54,-1.27
057-010-1 = drill 1 octagon: 1 -5.08,-1.27; 2 -5.08,1.27; 3 -2.54,-1.27; 4 -2.54,1.27; 5 0,-1.27; 6 0,1.27; 7 2.54,-1.27; 8 2.54,1.27; 9 5.08,-1.27; 10 5.08,1.27
XL4015 = drill 2 pad 2.8 square: IN+ 25.87,-10.16; IN- 25.87,9.84; OUT+ -24.13,-10.16; OUT- -24.13,9.84

### Placement (x,y rotation side)
5V  42.55,82.87 90 top
12VA  42.55,92.39 270 top
12VB  42.55,101.92 90 top
12VMTRA  133.03,124.46 0 top
12VMTRB  250.19,125.09 0 top
C1  65.72,28.89 0 bottom
CDACPY  70.8,95.25 0 top
CDBCPY  187.96,95.88 0 top
CONDRIVEA  70.8,92.71 0 top
CONDRIVEB  187.96,93.34 0 top
DIS1  210.19,52.07 0 top
GNDA  74.61,124.46 0 top
GNDB  191.77,125.09 0 top
JP1  118.43,31.43 0 top
JP2  118.43,28.89 0 top
JP3  118.43,26.35 0 top
JP4  82.87,40.64 180 top
JP5  90.49,40.64 0 top
JP6  126.68,82.23 0 top
JP7  66.36,61.6 0 top
JP8  32.07,122.55 180 top
LED1  32.07,115.25 270 top
LED2  59.37,79.38 270 top
LED3  41.59,114.94 270 top
OK1  103.82,115.89 90 top
OK2  103.82,110.81 90 top
OK3  103.82,105.73 270 top
OK4  103.82,100.65 270 top
OK5  220.66,116.84 90 top
OK6  220.66,111.76 90 top
OK7  220.66,106.68 270 top
OK8  220.66,101.6 270 top
Q1  86.04,114.3 270 bottom
Q2  86.04,102.87 90 top
Q3  70.8,114.3 270 top
Q4  70.8,102.87 90 bottom
Q5  136.84,114.3 270 bottom
Q6  136.84,102.87 90 top
Q7  121.6,114.3 270 top
Q8  121.6,102.87 90 bottom
Q9  203.2,114.94 270 bottom
Q10  203.2,103.5 90 top
Q11  187.96,114.94 270 top
Q12  187.96,103.5 90 bottom
Q13  254,114.94 270 bottom
Q14  254,103.5 90 top
Q15  238.76,114.94 270 top
Q16  238.76,103.5 90 bottom
R1  88.9,114.3 270 top
R2  88.9,102.87 90 top
R3  110.49,96.52 0 top
R4  110.49,93.98 0 top
R5  139.7,114.3 270 top
R6  139.7,102.87 90 top
R7  97.16,96.52 0 top
R8  97.16,93.98 0 top
R9  206.06,114.94 270 top
R10  206.06,103.5 90 top
R11  227.33,97.47 180 top
R12  65.72,32.7 90 bottom
R13  55.88,79.38 270 top
R14  227.33,94.93 180 top
R15  256.86,114.94 270 top
R16  256.86,103.5 90 top
R17  214,97.47 0 top
R18  214,94.93 0 top
R19  35.56,114.94 270 top
R20  28.57,114.94 90 top
R21  177.16,60.33 0 top
R22  211.77,59.37 0 top
R23  45.09,114.94 270 top
R24  38.1,114.94 90 top
R25  104.46,49.53 180 bottom
R26  104.46,51.75 180 bottom
R27  137.79,63.18 180 bottom
R28  64.45,75.88 270 bottom
R29  66.99,75.88 270 bottom
R30  72.07,75.88 270 bottom
S2  65.72,28.89 90 top
S5  78.42,28.89 90 top
S6  85.41,28.89 90 top
S7  92.39,28.89 90 top
S8  99.38,28.89 90 top
SERIAL5  56.52,32.07 0 top
SG1  139.38,76.83 0 top
T1  139.38,66.04 180 top
U1  92.08,82.55 270 top
U$1  92.08,77.47 90 top
U$2  136.84,95.25 0 top
U$3  115.89,51.12 270 top
U$4  143.83,35.24 270 top
U$5  68.26,79.38 0 top
U$10  254,95.88 0 top
U$11  254,93.34 0 top
U$14  136.84,92.71 0 top
V1  104.46,51.12 180 top
X1  155.89,85.09 270 top
X2  155.89,74.3 270 top
X3  155.89,63.5 270 top
X4  28.57,98.11 90 top
X5  56.83,108.58 90 top
X6  149.22,108.58 90 top
X7  173.67,109.22 90 top
X8  266.38,109.22 90 top
X9  235.9,59.05 0 top
X10  28.57,86.68 90 top
X21  57.15,51.12 270 top
XL4015  36.51,49.53 90 top

### Tracks (layer width: path | path; a pad name or v marks a point on that pad's centre or on a via)
3V1
  Bottom 0.406: U$3.3V3_MAX_250 118.43,45.4 117.95,45.88 106.52,45.88 106.05,46.36 106.05,49.84 R25.2 R26.2
3V2  (via drill 1)
  Top 0.406: v87.95,56.2 v77.79,56.2 | v61.28,56.2 v61.28,45.72
  Bottom 0.406: U$3.3V3_1 v87.95,56.2 | 65.72,34.29 R12.2 | v77.79,56.2 77.47,55.88 61.59,55.88 v61.28,56.2
  Bottom 0.61: v61.28,45.72 61.28,36.19 61.91,35.56 64.29,35.56 R12.2
12V  (via drill 1 pad 1.78)
  Top 0.61: v146.37,108.58 v146.37,119.7 | v96.2,121.92 v96.2,111.76
  Bottom 1.016: R23.2 45.09,109.54 45.72,108.9 52.39,108.9
  Bottom 1.27: 12VMTRA.10 144.46,119.7 | 12VMTRA.9 141.92,120.65 141.6,120.33 | 12VMTRA.8 139.38,120.65 139.7,120.33 | 12VMTRA.7 136.84,119.7 | 12VMTRA.6 134.3,119.7 | 12VMTRA.5 131.76,119.7 | 12VMTRA.4 129.22,119.7 | 12VMTRA.3 126.68,119.7 | 12VMTRA.2 124.14,120.33 124.78,119.7 | 12VMTRA.1 121.6,120.33 120.97,119.7
  Bottom 1.676: Q1.3 Q2.3 89.22,105.41 88.9,105.73 R2.2 | R1.2 88.9,111.13 89.53,111.76 Q1.3 | 143.19,108.58 Q6.3 140.02,105.41 139.7,105.73 R6.2 | R5.2 139.7,111.44 140.02,111.76 Q5.3 143.19,108.58 | 143.19,108.58 v146.37,108.58 | v146.37,119.7 144.46,119.7 142.24,119.7 141.6,120.33 139.7,120.33 137.79,120.33 137.16,119.7 136.84,119.7 134.3,119.7 131.76,119.7 129.22,119.7 126.68,119.7 124.78,119.7 120.97,119.7 117.47,119.7 115.25,121.92 v96.2,121.92 95.89,121.6 54.93,121.6 52.39,119.06 52.39,108.9 52.39,93.03 51.75,92.39 12VA.1 | v96.2,111.76 Q1.3
  Bottom 1.778: 12VMTRA.10 12VMTRA.1
12VDNMX  (via drill 1)
  Top 1.422: v30.48,106.68 v23.5,106.68
  Bottom 1.27: X3.2 158.12,63.5 159.07,64.45 159.07,73.34 158.27,74.14 | X2.2 158.12,74.3 158.27,74.14 | X1.2 158.12,85.09 159.07,84.14 159.07,74.93 158.27,74.14 | 148.27,127 159.38,115.89 159.38,84.46
  Bottom 1.422: 35.56,106.68 46.04,106.68 47.24,105.47 12VB.3 | 35.56,106.68 v30.48,106.68 | 148.27,127 47.31,127 29.84,127 26.35,123.51 23.5,120.65 v23.5,106.68 | 159.38,84.46 159.07,84.14 | R19.2 35.56,106.68
12VDRV  (via drill 1 pad 1.42)
  Top 0.61: v264.16,109.22 v264.16,120.02 | v212.72,113.35 v212.72,123.82
  Bottom 0.813: R15.2 256.86,111.44 257.81,112.4
  Bottom 1.27: 12VMTRB.10 261.62,121.6 261.3,121.29 | 12VMTRB.9 259.08,121.29 | 12VMTRB.8 256.54,121.29 | 12VMTRB.7 254,121.6 253.68,121.29 | 12VMTRB.6 251.46,121.29 | 12VMTRB.5 248.92,121.29 | 12VMTRB.4 246.38,121.6 246.06,121.29 | 12VMTRB.3 243.84,121.6 243.52,121.29 | 12VMTRB.2 241.3,121.92 241.94,121.29 | 12VMTRB.1 238.76,121.29
  Bottom 1.676: 260.35,109.22 Q14.3 257.49,106.05 256.86,106.68 R16.2 | 260.35,109.22 Q13.3 257.81,112.4 257.18,112.4 256.86,112.08 R15.2 | Q9.3 Q10.3 206.69,106.05 206.06,106.68 R10.2 | Q9.3 206.38,112.4 206.06,112.08 R9.2 | 260.35,109.22 v264.16,109.22 | v264.16,120.02 262.89,121.29 261.3,121.29 259.08,121.29 256.54,121.29 253.68,121.29 251.46,121.29 248.92,121.29 246.06,121.29 243.52,121.29 241.94,121.29 238.76,121.29 234,121.29 231.46,123.82 v212.72,123.82 | Q9.3 211.77,112.4 v212.72,113.35
  Bottom 1.778: 12VMTRB.1 12VMTRB.10
B
  Bottom 0.813: U$3.30 70.17,70.49 69.53,71.12 65.09,71.12 64.45,71.76 R28.2
B1
  Bottom 0.61: S5.2 73.9,32.14 70.17,36.51 U$3.35
  Bottom 0.813: S5.2 S5.1
B2
  Bottom 0.61: 73.03,43.18 U$3.36 72.71,38.73 76.2,35.24 82.55,35.24 83.19,34.61 83.19,32.18 S6.2
  Bottom 0.813: S6.2 S6.1
B3  (via drill 1)
  Top 0.61: v90.17,36.83 v84.45,36.83
  Bottom 0.61: v84.45,36.83 77.79,36.83 75.25,39.37 U$3.37
  Bottom 0.813: S7.2 S7.1
  Bottom 1.016: S7.2 90.13,36.47 v90.17,36.83
B4  (via drill 1)
  Top 0.61: v93.03,38.42 v81.6,38.42
  Bottom 0.61: U$3.38 77.79,39.37 78.74,38.42 v81.6,38.42 | v93.03,38.42 97.16,34.29 97.16,32.18 S8.2
  Bottom 0.813: S8.2 S8.1
BUZZER  (via drill 1)
  Top 1.016: v77.79,78.42 v77.79,84.77 | v90.17,84.77 v118.75,84.77
  Bottom 1.016: U$3.27 v77.79,78.42 | v77.79,84.77 v90.17,84.77 | v118.75,84.77 118.11,84.77 117.79,84.46 117.79,63.18 118.75,62.23 135.42,62.23 R27.1
CONTRLCD
  Bottom 0.61: R21.S 177.16,59.37 178.12,58.42 182.88,58.42 183.2,58.74 183.2,67.5 DIS1.3
D4
  Bottom 0.406: 61.28,53.34 60.01,52.39 57.15,52.39 X21.3
  Bottom 0.61: U$3.25 82.87,54.93 81.6,53.34 61.28,53.34
D4LCD  (via drill 1)
  Top 0.813: v204.15,56.83 v208.6,56.83
  Bottom 0.813: X9.3 233.36,56.2 232.73,55.56 209.55,55.56 208.6,56.51 v208.6,56.83 | DIS1.11 203.59,65.97 204.47,65.09 204.47,57.15 v204.15,56.83
D5
  Bottom 0.406: 60.33,49.85 57.15,49.85 X21.5
  Bottom 0.61: U$3.12 90.49,55.88 85.41,50.8 61.28,50.8 60.33,49.85
D5LCD
  Bottom 0.813: X9.5 235.9,55.56 | 235.9,55.56 235.59,55.25 | DIS1.12 206.12,56.13 207.96,54.29 235.59,54.29 235.9,54.61 235.9,55.56
D6
  Bottom 0.61: U$3.26 80.33,55.88 79.38,54.61 60.33,54.61 59.05,53.66 X21.4
D6LCD  (via drill 1)
  Top 0.813: v228.28,58.1 v228.28,62.86
  Bottom 0.813: X9.4 233.36,61.91 232.41,62.86 v228.28,62.86 | DIS1.13 208.66,65.34 210.19,63.82 210.19,58.74 211.46,57.47 227.65,57.47 v228.28,58.1
D7
  Bottom 0.61: X21.6 60.01,51.12 61.28,52.07 83.19,52.07 85.41,54.29 U$3.24
D7LCD  (via drill 1)
  Top 0.813: v212.09,65.09 v220.03,65.09
  Bottom 0.813: X9.6 235.9,62.55 233.36,65.09 v220.03,65.09 | DIS1.14 211.21,65.97 v212.09,65.09
DIN  (via drill 1)
  Top 0.813: v113.35,52.71 v122.87,52.71
  Top 1.27: v136.53,52.71 v155.26,52.71
  Bottom 0.813: V1.3 V1.2 v113.35,52.71
  Bottom 1.27: X2.3 153.67,71.76 153.51,71.6 | 153.51,71.6 152.72,70.8 152.72,61.91 153.67,60.96 X3.3 155.26,60.33 v155.26,52.71 | X1.3 153.67,82.55 152.72,81.6 152.72,72.39 153.51,71.6 | v122.87,52.71 v136.53,52.71
DIR1
  Bottom 0.61: U$3.3 113.35,61.28 114.3,62.23 114.3,91.44 113.98,91.76 107.63,91.76 106.68,92.71 R4.1
DIR2
  Bottom 0.61: U$3.5 108.27,61.28 111.12,64.14 111.12,88.27 110.81,88.58 103.19,88.58 101.6,90.17 101.6,91.76 101.28,92.07 98.11,92.07 96.2,93.98 R8.1
DIR3
  Bottom 0.61: U$3.7 103.19,60.33 107.95,65.09 107.95,84.77 107.63,85.09 97.79,85.09 92.71,90.17 80.33,90.17 79.69,90.8 CONDRIVEA.9
  Bottom 1.016: CONDRIVEA.9 CDACPY.9
DIR3DRV  (via drill 1)
  Top 0.61: v207.65,93.03 v221.93,93.03
  Bottom 0.61: CONDRIVEB.9 196.85,92.07 197.17,91.76 204.79,91.76 206.06,93.03 v207.65,93.03 | v221.93,93.03 230.82,93.03 231.14,93.35 R14.1
  Bottom 1.016: CONDRIVEB.9 CDBCPY.9
DIR4
  Bottom 0.61: U$3.9 98.11,60.01 104.46,66.36 104.46,81.6 104.14,81.91 96.2,81.91 91.12,86.99 77.79,86.99 74.61,90.17 CONDRIVEA.7
  Bottom 1.016: CONDRIVEA.7 CDACPY.7
DIR4DRV
  Bottom 0.61: CONDRIVEB.7 191.77,90.17 192.41,89.54 209.23,89.54 210.19,90.49 R18.1
  Bottom 1.016: CONDRIVEB.7 CDBCPY.7
E  (via drill 1)
  Top 0.61: v95.41,46.99 v83.82,46.99
  Bottom 0.406: 60.64,47.31 57.15,47.31 X21.7
  Bottom 0.61: U$3.10 95.57,57.47 98.11,54.93 98.11,47.31 97.79,46.99 v95.41,46.99 | v83.82,46.99 83.19,47.62 60.96,47.62 60.64,47.31
ELCD  (via drill 1)
  Top 0.813: v238.44,50.16 v238.44,55.25
  Bottom 0.813: DIS1.6 190.88,51.37 192.09,50.16 v238.44,50.16 | v238.44,55.25 X9.7
EN  (via drill 1)
  Top 0.406: v100.01,51.28 v93.03,51.28
  Bottom 0.406: v100.01,51.28 100.01,52.86 100.49,53.34 108.9,53.34 109.54,52.71 110.49,52.71 113.35,49.85 | 90.65,43.97 90.65,43.66 U$3.13
  Bottom 0.61: U$3.13 JP5.1
  Bottom 0.813: V1.1 115.89,52.39 113.35,49.85 V1.19 | 90.65,43.97 90.65,49.21 92.71,51.28 v93.03,51.28
G
  Bottom 0.813: U$3.29 72.71,72.07 72.39,72.39 70.17,72.39 69.22,73.34 69.22,73.98 68.9,74.3 67.16,74.3 R29.2
GND  (via drill 1, 1 pad 1.93)
  Top 1.27: v155.89,79.69 v150.18,79.69 | v155.89,68.9 v150.18,68.9 | v48.58,118.74 v57.47,118.74
  Top 1.778: v50.48,30.16 v33.34,30.16
  Bottom 0.254: 87.95,50.16 87.31,32.39 87.63,32.07 87.63,22.54 | 63.5,25.6 S2.1
  Bottom 0.61: 87.31,32.5 S6.4 | S5.4 80.68,23.14 81.28,22.54 | 81.28,22.54 87.31,22.54 | 87.31,22.54 87.63,22.86 87.63,25.6 S6.3 | S7.4 94.65,22.9 94.3,22.54 | 94.3,22.54 87.63,22.54 87.31,22.54 | S8.3 101.64,22.9 101.28,22.54 94.3,22.54 | 81.28,22.54 64.14,22.54 63.5,23.18 63.5,25.6 | SERIAL5.1 52.7,29.53 51.75,28.58
  Bottom 0.813: OK4.2 103.82,99.38 | OK3.2 102.23,104.46 | OK4.3 103.82,99.38 | 103.82,99.38 103.82,104.46 | OK2.3 102.23,112.08 | 102.23,112.08 103.82,112.08 | 103.82,112.08 OK2.2 112.71,112.08 113.35,111.44 Q7.3 | OK3.3 103.82,104.46 | 64.45,108.58 55.88,108.58 55.24,109.22 55.24,114.94 56.83,116.52 57.78,116.52 60.64,116.52 60.96,116.84 60.96,118.43 61.59,119.06 86.36,119.06 87.31,120.02 89.85,120.02 90.81,119.06 96.52,119.06 98.42,117.16 OK1.3 OK1.2 104.14,117.16 103.82,116.84 103.82,112.08 | 103.82,104.46 102.23,104.46 | 102.23,104.46 102.23,112.08 | S2.1 63.46,28.58 63.46,29.21 S2.2 | S5.4 S5.3 | S6.4 S6.3 | S7.4 S7.3 | S8.4 S8.3 | 27.3,71.44 48.58,71.44 55.88,79.38 R13.1 | 127.95,84.14 JP6.6 JP6.5 127.95,85.09 128.91,86.04 149.86,86.04 150.18,85.72
  Bottom 1.016: U$1.GND 85.72,70.17 89.53,73.98 U1.GND 89.53,80.65 88.58,81.6 69.53,81.6 | U$5.C 69.53,81.6 | X21.1 X21.2 | v57.47,118.74 57.47,116.84 57.78,116.52 | V1.10 92.71,54.93 87.95,50.16 U$3.GND2 87.95,39.37 87.31,38.73 87.31,32.5 | 69.53,81.6 69.53,82.55 68.9,83.19 R13.1 55.88,79.69 | 26.67,74.93 26.67,72.07 27.3,71.44
  Bottom 1.27: X3.1 v155.89,68.9 | X2.1 v155.89,79.69 | X1.1 150.81,87.63 150.18,86.99 150.18,85.72 v150.18,79.69 v150.18,68.9 148.59,67.31 T1.E 141.92,58.74 | 63.5,32.18 S2.2 | GNDA.1 GNDA.2 GNDA.3 GNDA.4 GNDA.5 GNDA.6 GNDA.7 GNDA.8 GNDA.9 GNDA.10 GNDA.1 | U$3.GND1 141.92,58.74 | 141.92,58.74 141.92,45.88 138.75,42.7 U$4.GND 145.73,37.78 146.53,36.99 146.53,24.61 140.18,24.61 138.75,26.35 JP3.8 JP3.7 JP3.6 JP3.5 JP3.4 JP3.3 JP3.2 JP3.1 102.35,26.35 S8.3 | 44.45,113.66 47.94,113.66 47.94,118.74 | GNDA.1 51.12,124.46 47.94,121.29 47.94,118.74 | 47.94,118.74 v48.58,118.74
  Bottom 1.422: 39.53,112.24 40.96,113.66 LED3.K 44.45,113.66 | 39.53,112.24 38.1,110.81 R24.1 | 39.53,112.24 37.78,113.98 LED1.K 31.11,113.98 28.57,111.44 R20.1 27.94,109.85 26.99,108.9 26.99,101.24 26.35,100.61
  Bottom 1.676: Q4.3 64.45,108.58 Q3.3 | Q7.3 Q8.3 | X21.2 26.99,56.2 26.67,55.88 | C1.2 63.78,28.89 63.46,29.21 | 25.04,89.18 24.73,89.18 24.45,88.9 24.45,99.06 25.08,99.69
  Bottom 1.778: 25.08,99.69 26,100.61 26.35,100.61 X4.2 30.48,101.24 | X10.2 25.04,89.18 24.45,88.58 24.45,80.65 26.67,78.42 XL4015.IN- | XL4015.OUT- 26.67,30.16 | 26.67,30.16 26.67,55.88 XL4015.IN- | 26.67,74.93 XL4015.IN- | 63.46,28.58 51.75,28.58 v50.48,30.16 | v33.34,30.16 26.67,30.16
  pour Bottom (isolate 1.778): 22.86,127.63 53.34,127.95 53.34,19.68 22.86,19.37
  pour Bottom (isolate 1.27): 160.34,19.37 160.34,127.63 130.33,127.63 130.33,19.53
GNDDRV
  Bottom 0.813: OK7.2 218.44,105.41 | 218.44,105.41 220.66,105.41 | 220.66,100.33 OK8.2 | OK6.3 218.44,113.03 | 218.44,113.03 220.66,113.03 | 220.66,113.03 OK6.2 226.06,113.03 226.69,112.4 Q15.3 | 220.66,118.11 OK5.3 215.26,118.11 213.36,120.02 208.28,120.02 207.33,120.97 204.47,120.97 203.52,120.02 203.2,120.02 200.98,120.02 198.12,120.02 195.58,120.02 193.04,120.02 190.5,120.02 187.96,120.02 185.42,120.02 182.88,120.02 180.66,120.02 179.07,120.02 176.85,117.79 173.67,117.79 171.77,115.89 171.77,109.85 172.4,109.22 181.61,109.22 | OK5.2 220.66,118.11 | 220.66,118.11 220.66,113.03 | OK8.3 220.66,100.33 | 220.66,100.33 220.66,105.41 | OK7.3 220.66,105.41 | 218.44,105.41 218.44,113.03
  Bottom 1.27: GNDB.1 180.34,120.33 180.66,120.02 | GNDB.2 182.88,120.02 | GNDB.3 185.42,120.02 | GNDB.4 187.96,120.02 | GNDB.5 190.5,120.02 | GNDB.6 193.04,120.02 | GNDB.7 195.58,120.02 | GNDB.8 198.12,120.02 | GNDB.9 200.66,120.33 200.98,120.02 | GNDB.10 203.2,120.02
  Bottom 1.676: Q16.3 Q15.3 | Q12.3 181.61,109.22 Q11.3
  Bottom 1.778: GNDB.10 GNDB.1
GNDLCD
  Bottom 0.61: 188.12,69.37 187.96,69.53 178.44,69.53 178.19,69.28 DIS1.1 178.12,67.5 178.12,65.72 177.8,65.41 175.58,65.41 174.62,64.45 R21.A | 188.12,69.37 188.28,69.21 188.28,67.64 DIS1.5 | 188.12,69.37 188.28,69.53 215.9,69.53 216.28,69.15 DIS1.16
  Bottom 0.813: X9.1 X9.2 217.81,60.33 216.53,61.6 216.53,67.32 DIS1.16
N$1
  Bottom 1.676: Q1.2 Q3.2 59.05,114.3 58.1,113.35 X5.2
N$2
  Bottom 1.676: Q2.2 Q4.2 59.05,102.87 58.1,103.82 X5.1
N$3
  Bottom 0.813: Q1.1 95.25,116.84 97.47,114.62 OK1.4
  Bottom 1.676: Q3.1 89.22,116.84 | 89.22,116.84 Q1.1 | R1.1 88.9,117.16 89.22,116.84
N$4
  Bottom 1.676: Q7.2 Q5.2 149.54,114.3 150.5,113.35 X6.2
N$5
  Bottom 1.016: T1.B 139.38,63.35 R27.2
N$6
  Bottom 0.61: 170.18,88.58 271.78,88.58 271.78,127.95 170.18,127.95 170.18,88.58
N$7
  Bottom 0.61: Q2.1 94.3,100.33 94.93,100.96 94.93,107.95 95.89,108.9 99.38,108.9 OK2.4
  Bottom 1.676: Q2.1 88.58,100.33 | 88.58,100.33 Q4.1 | R2.1 88.9,100.01 88.58,100.33
N$8
  Bottom 1.676: Q8.2 Q6.2 149.86,102.87 150.5,103.51 X6.1
N$9  (via drill 1 pad 1.42)
  Top 0.61: v104.78,107 v104.78,119.06
  Bottom 0.813: OK3.4 v104.78,107
  Bottom 1.676: 140.34,116.84 Q7.1 113.03,119.06 v104.78,119.06 | 140.34,116.84 Q5.1 | R5.1 139.7,117.47 140.34,116.84
N$10
  Bottom 0.813: Q8.1 112.08,100.33 110.49,101.92 OK4.4
  Bottom 1.676: Q8.1 139.7,100.33 | 139.7,100.33 Q6.1 | R6.1 139.7,100.33
N$11  (via drill 1)
  Top 0.61: v111.44,96.84 v111.44,114.3
  Bottom 0.61: v111.44,114.3 111.12,114.3 110.81,114.62 OK1.1
  Bottom 0.813: R3.1 107,96.84 v111.44,96.84
N$12
  Bottom 0.61: OK3.1 97.16,107 96.52,106.36 96.52,97.16 95.89,96.52 R7.1
N$13  (via drill 1)
  Top 0.61: v109.54,94.3 v109.54,109.22
  Bottom 0.61: v109.54,109.22 109.22,109.54 OK2.1
  Bottom 0.813: R4.2 109.86,93.98 v109.54,94.3
N$14
  Bottom 0.61: OK4.1 98.42,101.92 98.11,101.6 98.11,94.3 98.42,93.98 R8.2
N$15
  Bottom 1.676: Q9.2 Q11.2 175.58,114.94 174.94,114.3 X7.2
N$16
  Bottom 1.676: Q10.2 Q12.2 175.58,103.51 174.94,104.14 X7.1
N$17
  Bottom 0.813: Q9.1 212.09,117.47 214,115.57 OK5.4
  Bottom 1.676: Q11.1 206.06,117.47 | 206.06,117.47 Q9.1 | R9.1 206.06,117.47
N$18
  Bottom 0.61: Q10.1 211.46,100.96 211.77,101.28 211.77,108.9 213.04,110.17 216.53,110.17 OK6.4
  Bottom 1.676: Q10.1 206.38,100.96 | 206.38,100.96 Q12.1 | R10.1 206.06,100.65 206.38,100.96
N$19  (via drill 1)
  Top 0.61: v228.6,97.79 v228.6,115.25
  Bottom 0.61: R11.1 228.92,97.47 v228.6,97.79 | v228.6,115.25 228.28,115.57 OK5.1
N$20  (via drill 1 pad 1.42)
  Top 0.61: v227.01,110.17 v227.01,95.25
  Bottom 0.813: OK6.1 226.69,110.49 v227.01,110.17 | v227.01,95.25 227.01,94.93 R14.2
N$21
  Bottom 1.676: Q15.2 Q13.2 266.7,114.94 267.65,113.98 X8.2
N$22
  Bottom 1.676: Q16.2 Q14.2 266.7,103.51 267.65,104.46 X8.1
N$23  (via drill 1 pad 1.42)
  Top 0.61: v221.93,107.95 v221.93,120.33
  Bottom 0.813: OK7.4 v221.93,107.95
  Bottom 1.676: 256.86,117.47 Q15.1 229.55,120.33 v221.93,120.33 | 256.86,117.47 Q13.1 | R15.1 256.86,117.47
N$24
  Bottom 0.813: Q16.1 229.87,100.96 227.97,102.87 OK8.4
  Bottom 1.676: Q14.1 256.86,100.96 | 256.86,100.96 Q16.1 | R16.1 256.86,100.96
N$25
  Bottom 0.61: R17.1 212.72,97.47 213.04,97.79 213.04,107.63 213.36,107.95 OK7.1
N$26
  Bottom 0.61: OK8.1 214.63,102.87 214.31,102.55 214.31,95.57 214.95,94.93 R18.2
N$27
  Bottom 0.813: 18.1,129.54 164.78,129.54 164.78,16.83 18.1,16.83 18.1,129.54
N$28
  pour Bottom (isolate 1.016): 172.72,67.63 247.65,67.63 247.65,36.51 172.72,36.51
N$29
  Bottom 0.813: 175.58,69.21 171.13,69.21 171.13,34.93 249.24,34.93 249.24,69.21 218.44,69.21
N$30
  pour Bottom (isolate 1.676): 53.34,127.63 129.86,127.63 129.86,19.53 53.34,19.53
N$31
  Bottom 1.778: X4.1 33.7,95.61 35.24,97.16 40.96,97.16 42.55,98.74 12VB.2
N$32
  Bottom 0.61: U$3.39 JP4.3
N$33
  Bottom 1.778: 5V.2 42.55,87.63 | 42.55,87.63 12VA.2 | X10.1 31.79,84.18 35.24,87.63 42.55,87.63
N$34
  Bottom 1.778: XL4015.IN+ 46.67,82.3 5V.3
N$35
  Bottom 1.27: R13.2 58.74,75.57 59.37,76.2 LED2.K
N$36
  Bottom 1.778: U$10.1 U$10.2 U$10.3 U$10.4 U$10.5 U$10.6 U$10.7 U$10.8 U$10.9 U$10.10
N$37
  Bottom 1.676: U$5.B R28.1
N$38
  Bottom 1.016: SG1.- 135.57,73.34 136.84,72.07 T1.C
N$39
  Bottom 1.676: U$5.G R29.1
N$40
  Bottom 1.676: U$5.R R30.1
N$41
  Bottom 0.61: U$3.A21 JP4.2
N$42
  Bottom 0.813: R22.2 215.26,60.01 214.31,60.96 214.31,67 DIS1.15
N$43
  Bottom 0.61: U$3.A22 JP4.1
N$44
  Bottom 1.778: U$2.1 U$2.2 U$2.3 U$2.4 U$2.5 U$2.6 U$2.7 U$2.8 U$2.9 U$2.10
N$45
  Bottom 1.778: U$14.10 U$14.9 U$14.8 U$14.7 U$14.6 U$14.5 U$14.4 U$14.3 U$14.2 U$14.1
N$46
  Bottom 0.406: U$3.32 JP7.1
N$47
  Bottom 0.406: U$3.31 JP7.2
N$48
  pour Bottom (isolate 1.27): 271.78,88.58 170.18,88.58 170.18,127.95 271.78,127.95
N$49
  Bottom 1.778: U$11.1 U$11.2 U$11.3 U$11.4 U$11.5 U$11.6 U$11.7 U$11.8 U$11.9 U$11.10
N$50
  pour Bottom (isolate 1.016): 21.91,128.59 29.84,128.59 29.84,120.49 21.91,120.49
N$51
  pour Bottom (isolate 1.27): 161.29,128.59 149.38,128.59 149.38,116.84 161.29,116.84
PWM1
  Bottom 0.61: U$3.2 115.89,91.76 116.84,92.71 116.84,95.88 116.2,96.52 R3.2
PWM2
  Bottom 0.61: U$3.4 110.81,61.28 112.71,63.18 112.71,89.54 112.39,89.85 104.14,89.85 103.19,90.8 103.19,95.57 102.23,96.52 R7.2
PWM3
  Bottom 0.61: U$3.6 105.73,60.96 109.54,64.77 109.54,86.68 109.22,86.99 100.33,86.99 95.57,91.76 91.76,91.76 90.81,92.71 CONDRIVEA.10
  Bottom 1.016: CONDRIVEA.10 CDACPY.10
PWM3DRV  (via drill 1)
  Top 0.61: v207.65,96.2 v221.3,96.2
  Bottom 0.61: v221.3,96.2 222.88,97.47 R11.2 | v207.65,96.2 207.01,96.2 204.15,93.35 CONDRIVEB.10
  Bottom 1.016: CONDRIVEB.10 CDBCPY.10
PWM4
  Bottom 0.61: U$3.8 100.65,60.01 106.36,65.72 106.36,83.19 106.05,83.5 97.16,83.5 92.08,88.58 78.74,88.58 77.15,90.17 CONDRIVEA.8
  Bottom 1.016: CONDRIVEA.8 CDACPY.8
PWM4DRV  (via drill 1)
  Top 0.61: v207.65,90.8 v219.71,90.8
  Bottom 0.61: CONDRIVEB.8 194.31,91.44 194.94,90.8 v207.65,90.8 | v219.71,90.8 219.71,97.16 219.39,97.47 R17.2
  Bottom 1.016: CONDRIVEB.8 CDBCPY.8
R
  Bottom 0.813: U$3.28 75.25,73.34 74.3,74.3 72.24,74.3 R30.2
RESET
  Bottom 0.406: 62.55,44.13 63.18,44.77 63.18,46.04 63.5,46.36 77.47,46.36 U$3.RESET
  Bottom 0.61: 62.55,44.13 62.55,37.15 62.87,36.83 66.67,36.83 67.94,35.56 67.94,32.18 S2.4
  Bottom 0.813: S2.3 67.98,28.89 | 67.98,28.89 S2.4 67.98,31.47 67.94,31.43 65.87,31.43 R12.1 | C1.1 67.98,28.89
RS  (via drill 1)
  Top 0.61: v95.41,49.21 v83.82,49.21
  Bottom 0.406: 60.64,48.58 X21.8
  Bottom 0.61: U$3.11 93.03,57.47 95.57,54.93 95.57,49.53 95.25,49.21 v95.41,49.21 | v83.82,49.21 61.28,49.21 60.64,48.58
RSLCD
  Bottom 0.813: DIS1.4 185.81,49.78 187.32,48.26 242.25,48.26 243.52,49.53 243.52,62.55 242.57,63.5 238.76,63.5 238.44,63.18 X9.8
RX1  (via drill 1)
  Top 0.813: v110.81,49.21 v120.97,49.21
  Bottom 0.813: V1.18 v110.81,49.21 | v120.97,49.21 U$3.0
RX5  (via drill 1)
  Top 0.61: v67.63,38.42 v59.37,38.42
  Bottom 0.61: U$3.34 67.63,38.73 67.31,38.42 v67.63,38.42 | v59.37,38.42 59.37,34.61 60.33,33.65 SERIAL5.4
SCL0  (via drill 1)
  Top 0.61: v106.05,41.59 v106.05,19.68
  Top 0.813: v102.23,78.74 v125.41,78.74
  Top 1.016: v80.64,65.41 v62.87,65.41 | v41.27,59.69 v41.27,50.8
  Bottom 0.406: R26.1 104.46,51.75 104.46,46.04 105.73,44.77 U$3.19 105.73,41.91
  Bottom 0.61: 105.73,41.91 v106.05,41.59
  Bottom 0.813: v41.27,50.8 41.27,21.59 43.18,19.68 v106.05,19.68 | v62.87,65.41 55.88,65.41 52.39,61.91 41.59,61.91 41.27,61.6 v41.27,59.69 | U1.SCL 92.08,79.38 92.71,80.01 100.97,80.01 v102.23,78.74 | JP6.4 JP6.3 v125.41,78.74
  Bottom 1.016: U1.SCL 92.08,73.66 88.27,69.85 U$1.SCL 88.27,66.04 87.63,65.41 v80.64,65.41
SDA0  (via drill 1)
  Top 0.61: v103.5,41.59 103.5,32.7 103.82,32.39 103.82,24.45 v104.14,24.13
  Top 0.813: v80.64,62.86 v62.23,62.86 | v45.09,59.05 v45.09,50.8 | v101.6,72.07 v122.87,72.07
  Bottom 0.406: U1.SDA 94.61,73.34 93.03,71.76
  Bottom 0.61: U$3.18 103.03,43.5 R25.1 | 103.03,42.38 103.03,43.35 U$3.18 | U$3.18 103.19,41.91 v103.5,41.59 | v104.14,24.13 104.14,23.18
  Bottom 0.813: U$1.SDA 90.81,63.82 89.85,62.86 v80.64,62.86 | v62.23,62.86 57.15,62.86 53.34,59.05 v45.09,59.05 | v45.09,50.8 45.09,47.62 43.81,46.36 43.81,28.26 43.18,27.62 43.18,22.86 44.77,21.27 102.23,21.27 104.14,23.18 | 93.03,71.76 101.28,71.76 v101.6,72.07 | v122.87,72.07 JP6.1 JP6.2
  Bottom 1.016: U1.SDA 94.61,73.66 90.81,69.85 U$1.SDA
T1
  Bottom 0.61: JP1.1 109.54,32.07 106.68,34.93 99.38,34.93 93.03,41.28 U$3.14
T2
  Bottom 0.61: JP1.2 112.08,32.07 107.95,36.19 100.01,36.19 95.57,40.64 U$3.15
T3
  Bottom 0.61: JP1.3 114.62,31.75 108.58,37.78 100.65,37.78 98.11,40.32 U$3.16
T4
  Bottom 0.61: JP1.4 117.16,34.29 116.2,35.24 113.35,35.24 109.22,39.37 101.28,39.37 100.65,40.01 U$3.17
T5
  Bottom 0.61: JP1.5 119.7,35.24 118.43,36.51 114.3,36.51 108.58,42.23 108.58,43.18 U$3.20
T6
  Bottom 0.61: JP1.6 122.24,34.61 119.06,37.78 114.94,37.78 111.12,41.59 111.12,43.18 U$3.21
T7
  Bottom 0.61: JP1.7 124.78,33.97 119.7,39.05 115.57,39.05 113.35,41.28 U$3.22
T8
  Bottom 0.61: JP1.8 127.32,33.02 120.02,40.32 116.2,40.32 115.89,40.64 U$3.23
TX1  (via drill 1)
  Top 0.813: v108.27,50.8 v118.43,50.8
  Bottom 0.813: V1.17 v108.27,50.8 | v118.43,50.8 U$3.1
TX5  (via drill 1)
  Top 0.61: v65.09,40.64 v57.47,40.64
  Bottom 0.61: U$3.33 v65.09,40.64 | v57.47,40.64 57.47,32.39 SERIAL5.3
VCC  (via drill 1)
  Top 1.016: v80.64,68.58 v62.87,68.58 | v49.53,64.45 v49.53,51.75 | v132.08,65.09 v132.08,47.31 | v87,78.1 v97.47,78.1 | v101.92,74.61 v128.59,74.61
  Bottom 0.61: SERIAL5.2 55.24,45.4 X21.9
  Bottom 0.813: V1.20 122.87,47.31 123.51,46.67 U$3.VIN | JP6.7 JP6.8 | JP6.7 130.49,82.23 | v97.47,78.1 99.69,78.1 101.92,75.88 v101.92,74.61 | JP6.7 132.56,78.9
  Bottom 1.016: X21.9 X21.10 | v80.64,68.58 U$1.VCC 83.19,70.17 87,73.98 U1.VCC v87,78.1 | v49.53,51.75 49.53,46.36 49.85,46.04 | JP2.8 134.3,28.89 134.94,29.53 134.94,42.54 133.99,43.5 132.08,43.5 | U$3.VIN 132.08,43.5 | SG1.+ 143.19,78.42 140.97,80.65 134.3,80.65 132.56,78.9 132.08,78.42 132.08,74.61 | 132.08,74.61 v132.08,65.09 | v132.08,47.31 132.08,43.5 | v128.59,74.61 132.08,74.61 | v62.87,68.58 61.91,68.58 | 61.91,68.58 58.42,68.58 55.56,71.44 51.75,71.44 49.53,69.21 v49.53,64.45 | 61.91,80.33 61.91,68.58
  Bottom 1.27: LED2.A 61.59,80.65 61.91,80.33 | JP2.1 JP2.2 JP2.3 JP2.4 JP2.5 JP2.6 JP2.7 JP2.8 | 134.94,29.53 138.11,29.53 U$4.VBUS
  Bottom 1.676: XL4015.OUT+ 46.67,42.86 49.85,46.04 X21.9
VCCLCD  (via drill 1)
  Top 0.61: v180.66,62.55 v193.36,62.55
  Top 0.813: v202.56,62.55 v207.96,62.55
  Bottom 0.61: R21.E 179.71,62.55 | 180.66,65.41 179.71,64.45 179.71,62.55 | 180.66,65.41 180.66,67.5 DIS1.2 180.72,65.47 180.66,65.41 | 179.71,62.55 v180.66,62.55
  Bottom 0.813: X9.10 X9.9 240.98,53.66 240.03,52.71 198.44,52.71 197.8,53.34 v197.8,57.15 197.8,62.23 198.12,62.55 | v193.36,62.55 198.12,62.55 | 198.12,62.55 v202.56,62.55 | v207.96,62.55 R22.1
VOLA
  Bottom 0.61: JP8.1 37.15,122.55 38.1,121.6 R24.2
  Bottom 1.422: R24.2 38.1,118.43 40.32,116.21 LED3.A 42.86,116.21 45.09,118.43 R23.1
VOLB
  Bottom 0.61: LED1.A 32.07,119.06 30.8,120.33 JP8.2
  Bottom 1.422: R20.2 28.57,118.74 30.8,116.52 LED1.A 33.34,116.52 35.56,118.74 R19.1
(copper drawn outside any net)
  shapes: Bottom circle x22

### Text on the board
Bottom: Tirza Sarwono | otomasi.sv.ac.id | MecanumArmProject